# Altium project MAIN_BOARD.PrjPcb
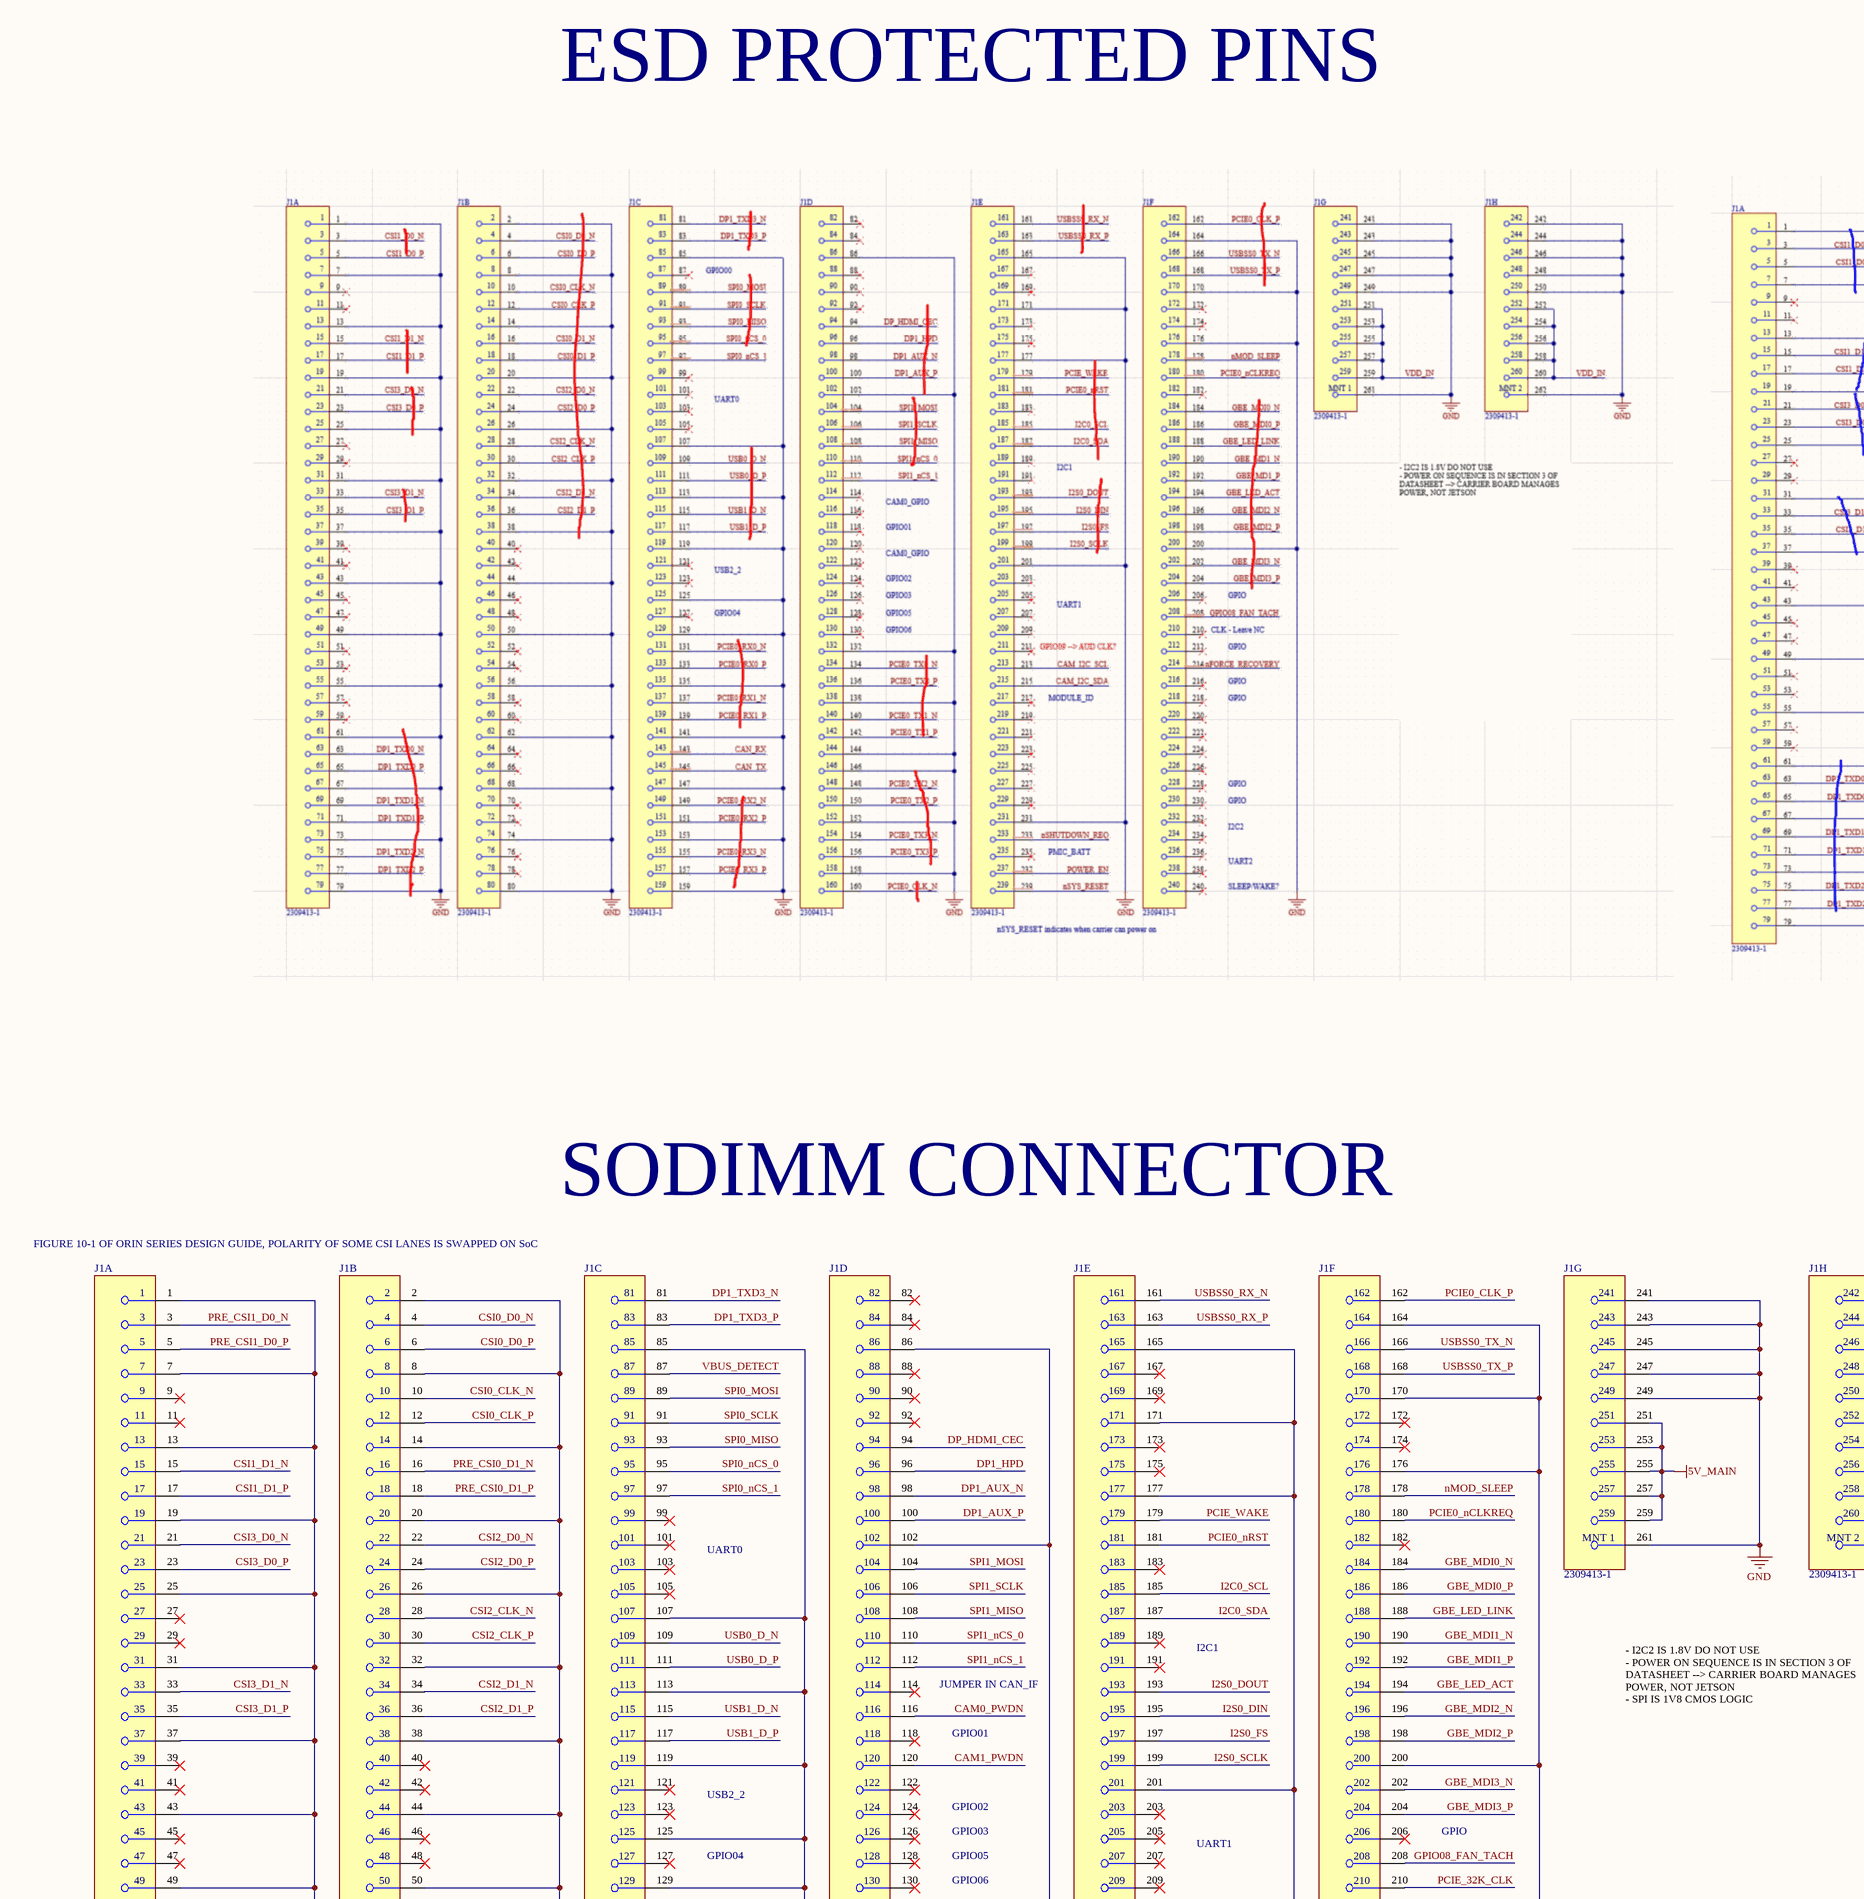
[diagram p0: JETSON.SchDoc, top left]
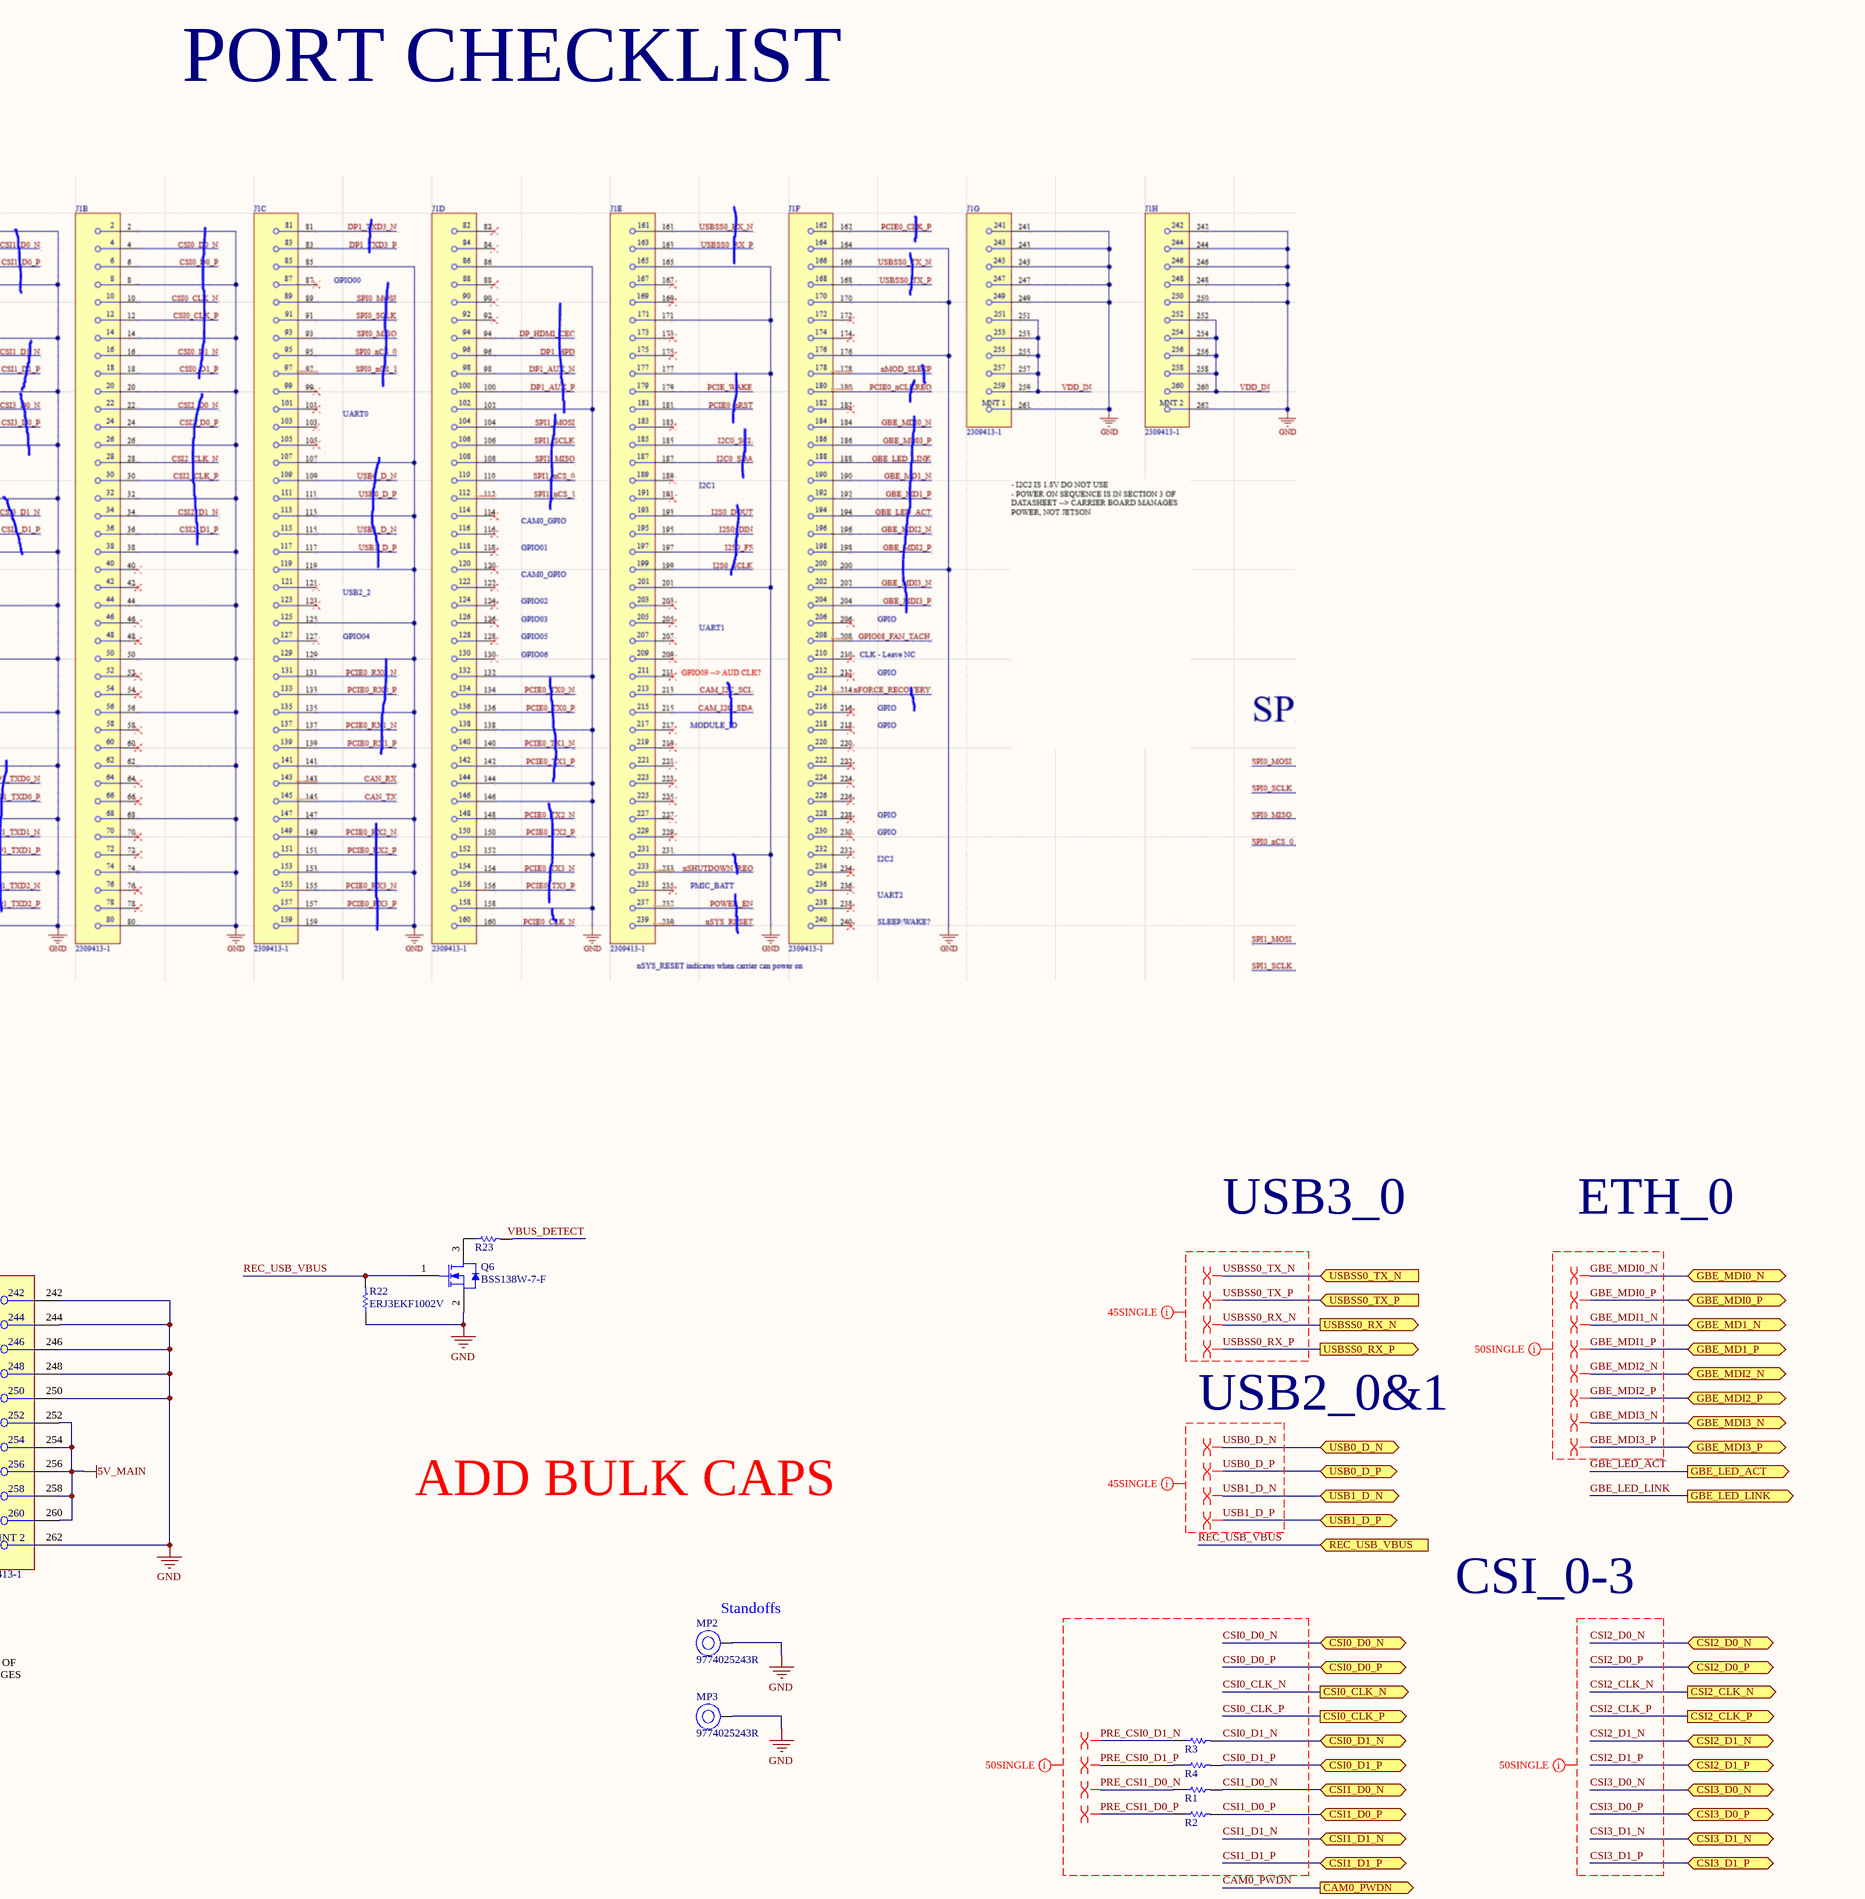
[diagram p1: JETSON.SchDoc, top right]
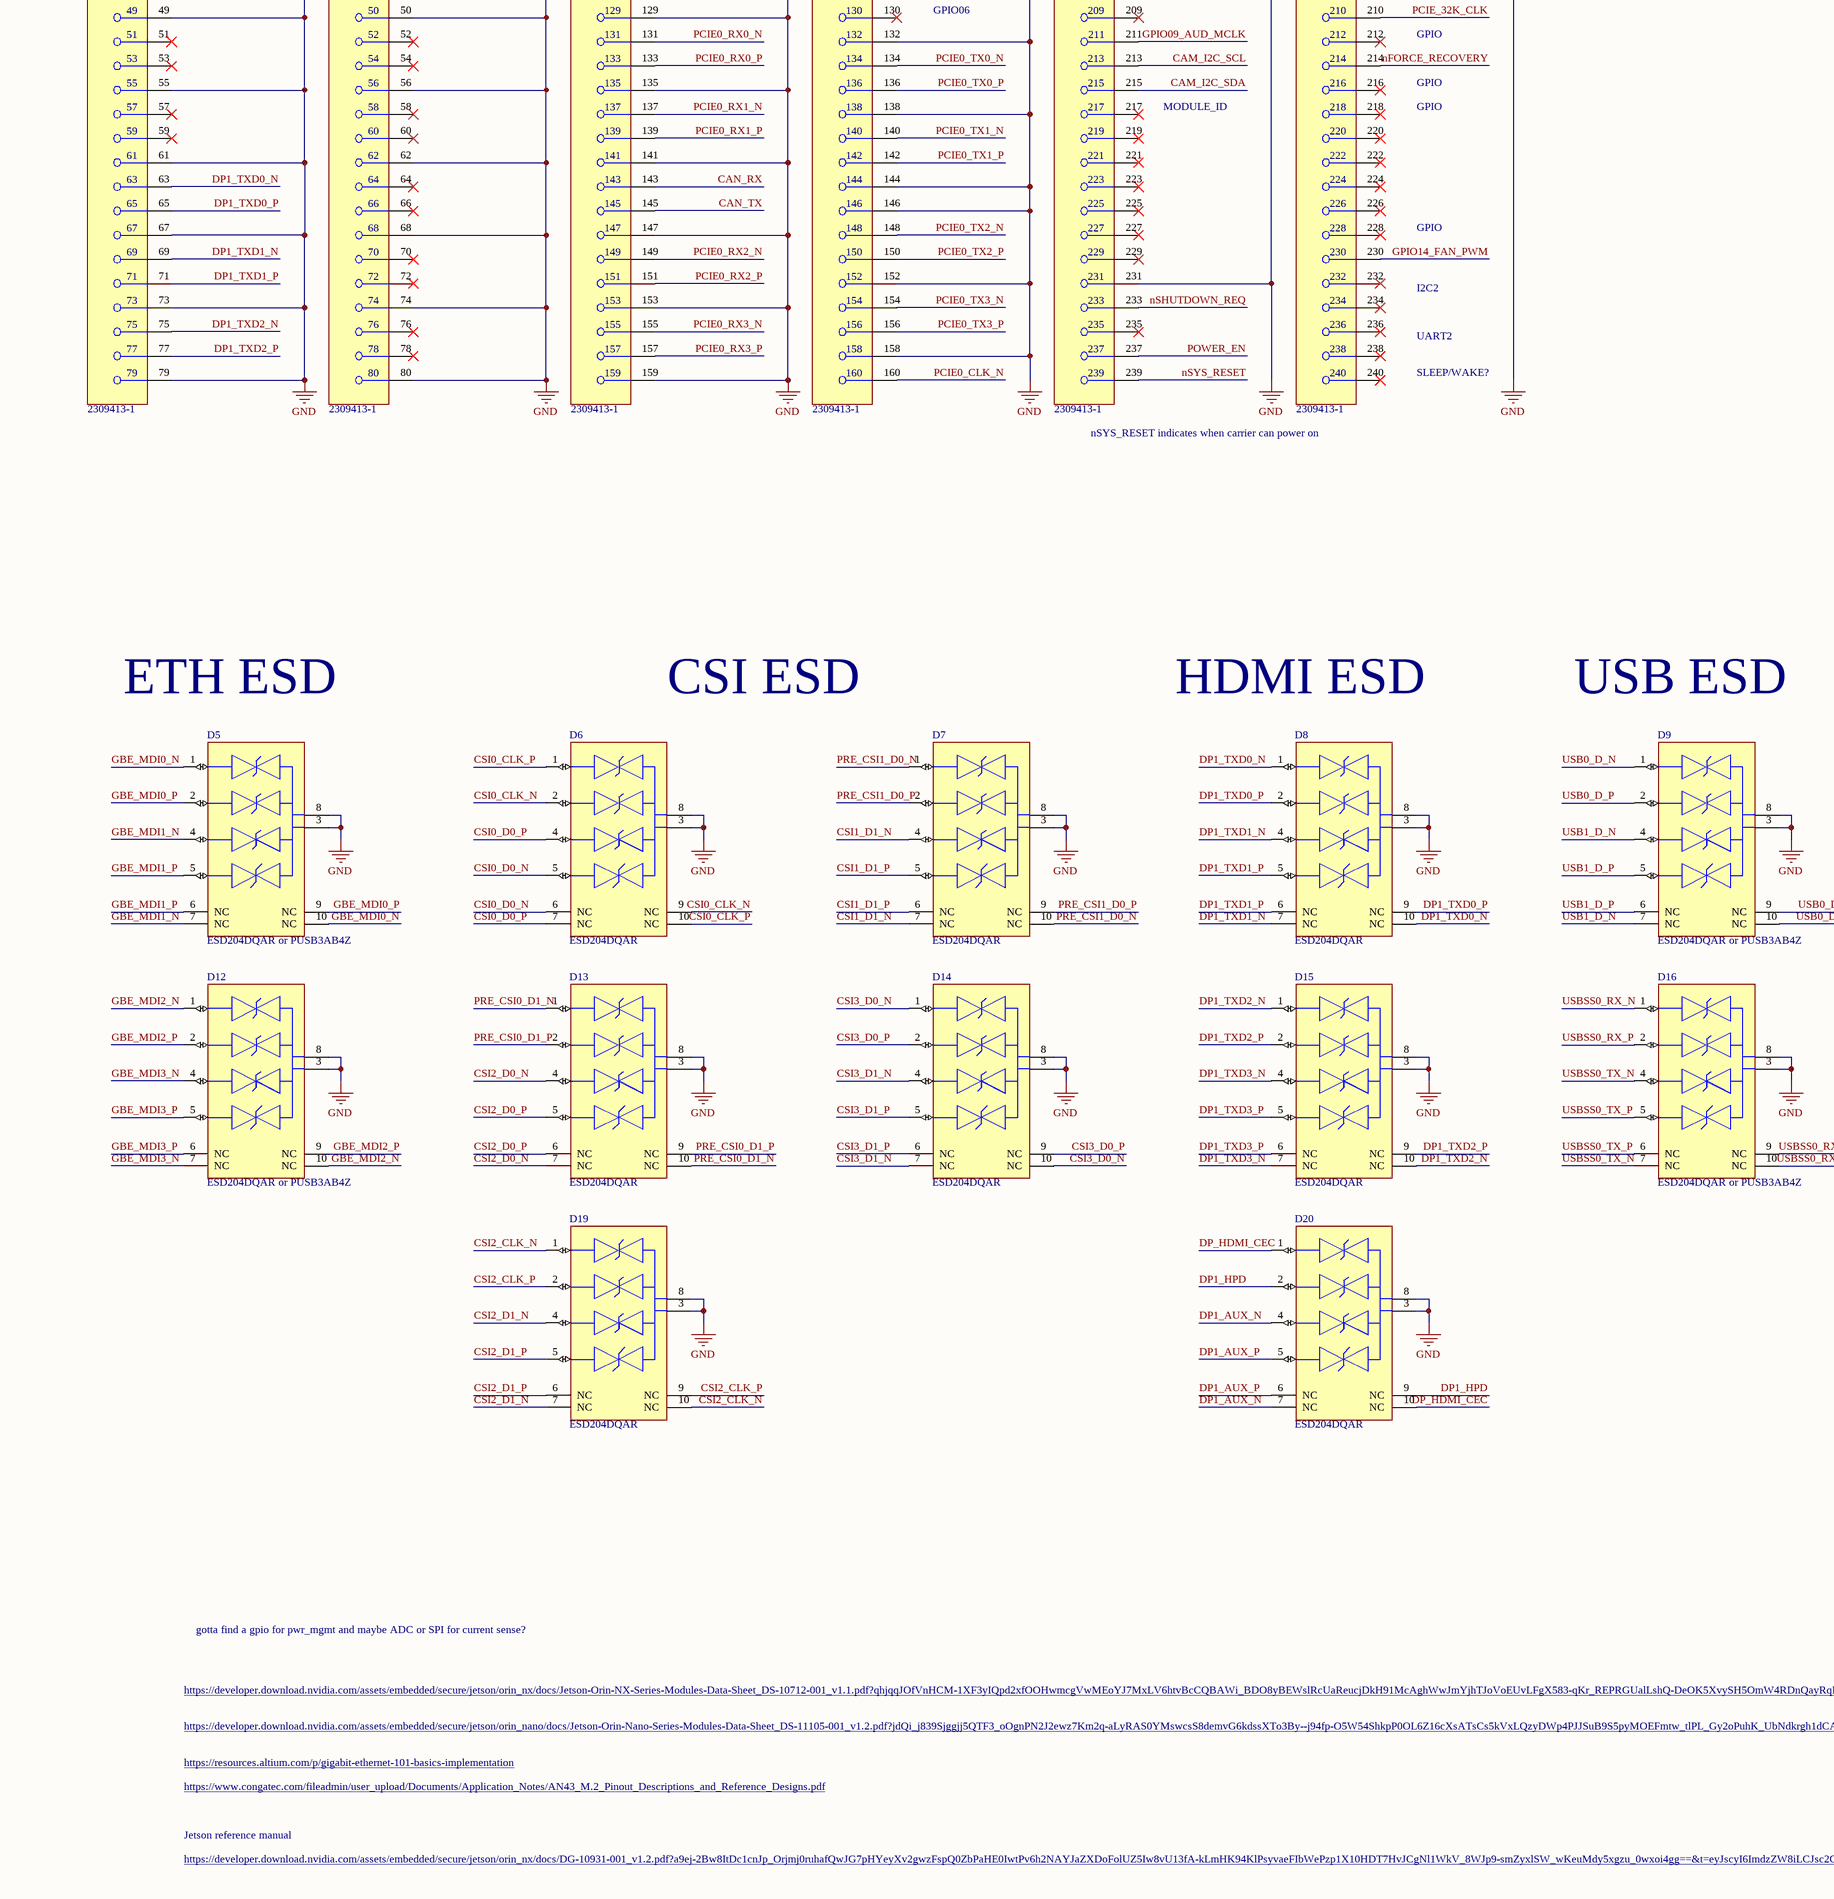
[diagram p2: JETSON.SchDoc, bottom left]
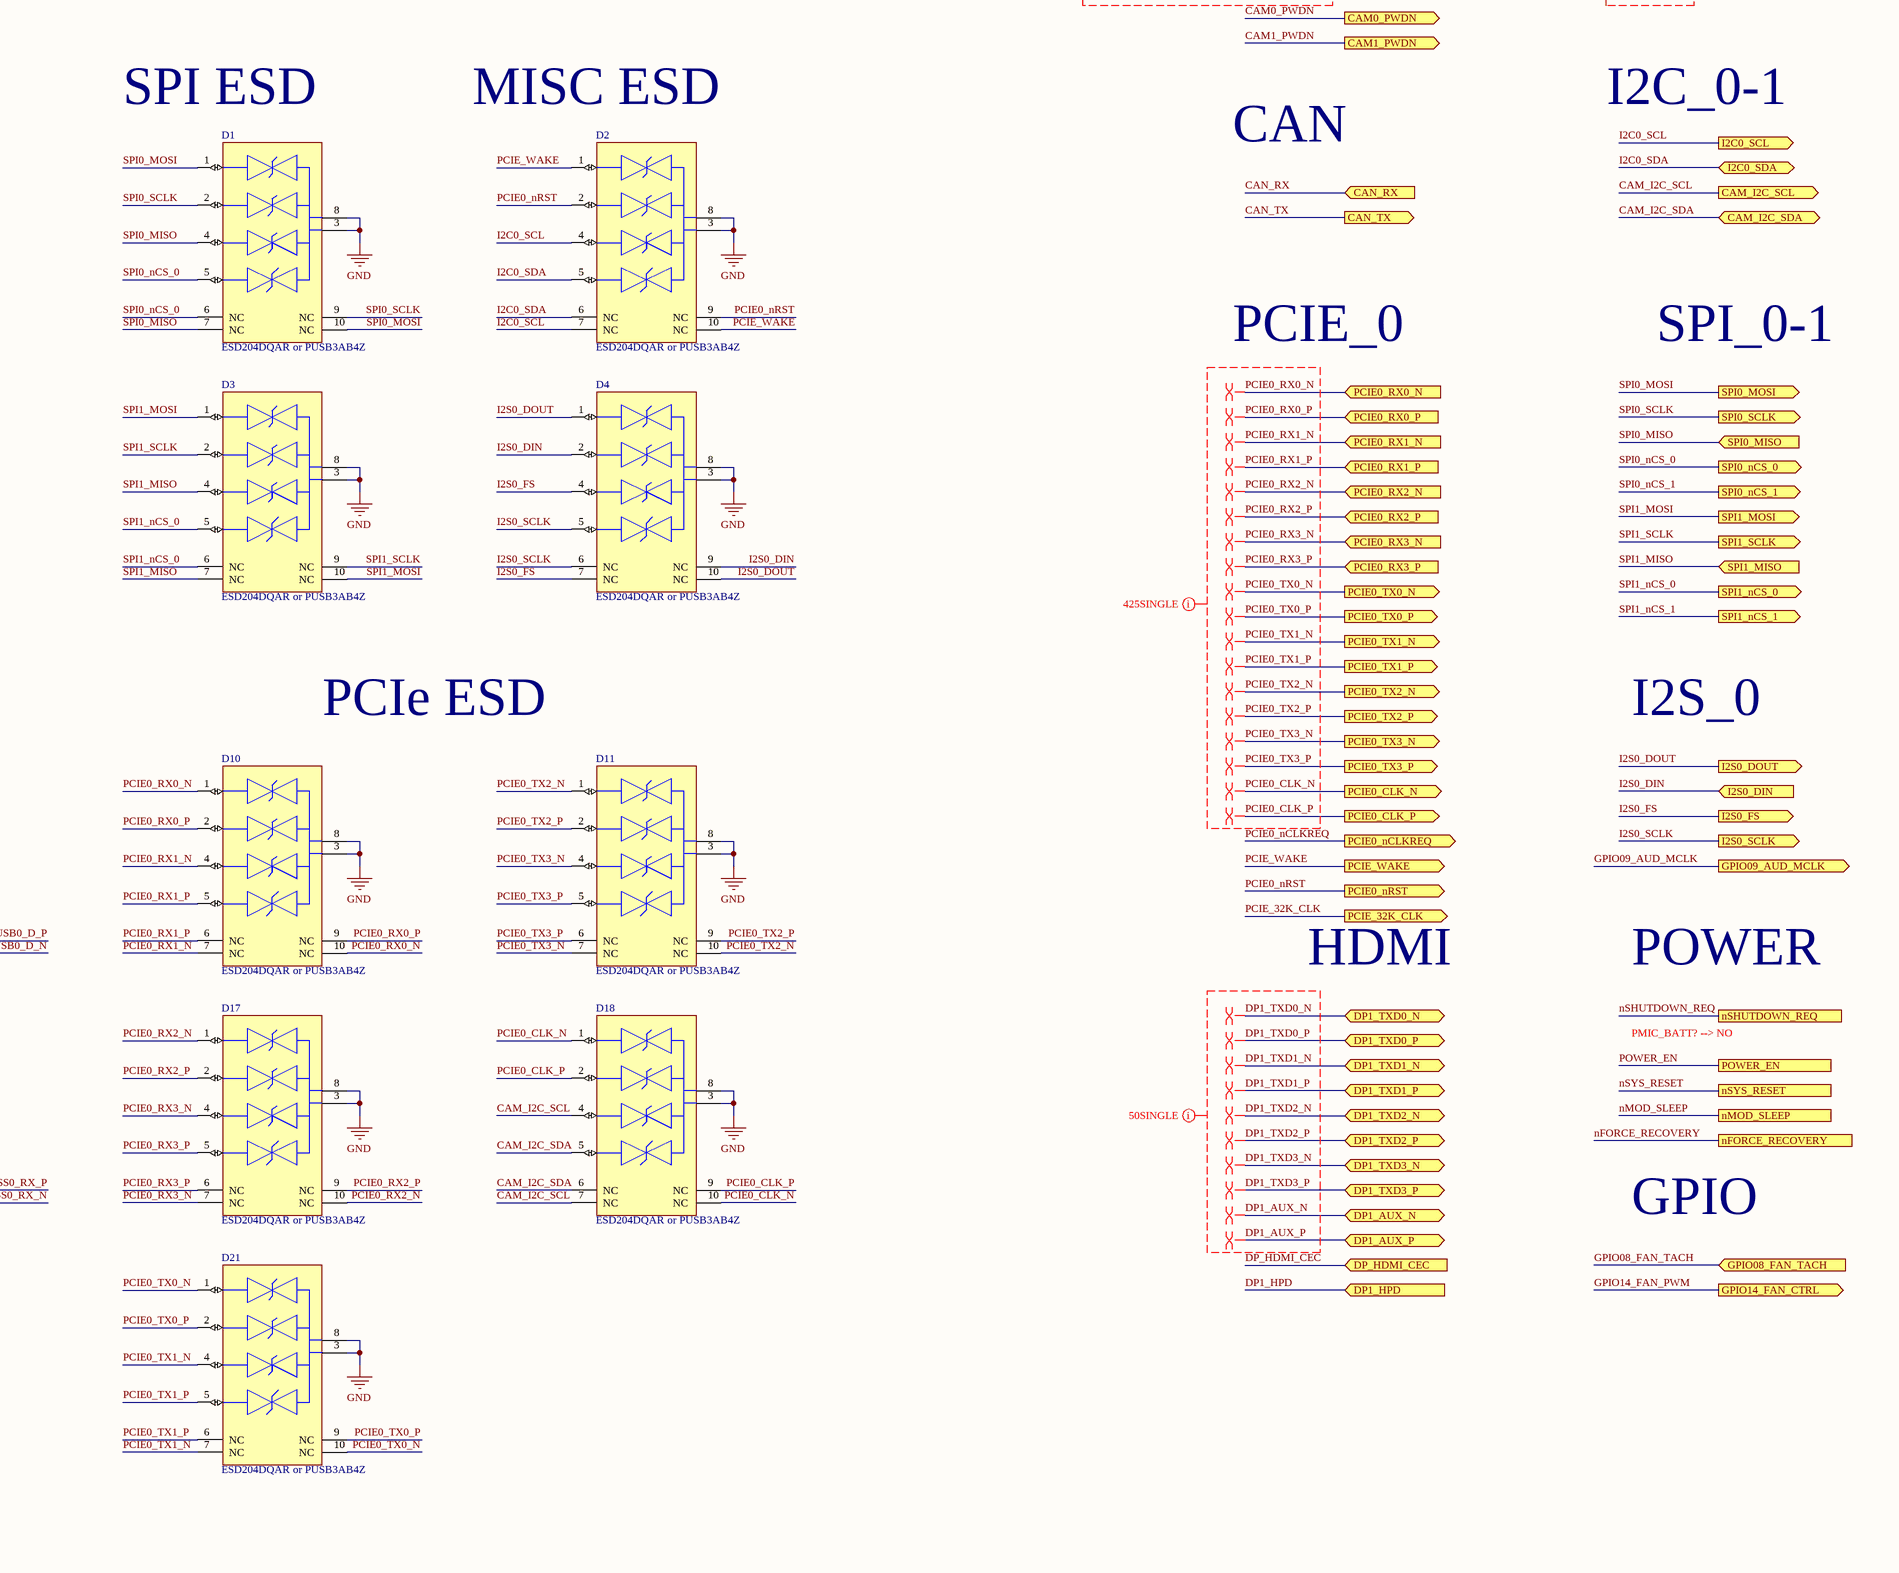
[diagram p3: JETSON.SchDoc, bottom right]
3 sheets, 113 parts. Net scope: flat (ports and power ports of the same name join across sheets).
Board files: MAIN_BOARD.PcbDoc, MAIN_BOARD_V2.PcbDoc
Sheets:
  JETSON.SchDoc
  CAMERA_INTERFACE.SchDoc
  FAN_IF.SchDoc

## Sheet JETSON.SchDoc
size D; SheetNumber: 2; SheetTotal: 9

### Parts
D1  ESD204DQAR or PUSB3AB4Z  [FP-DQA0010A-MFG]
D2  ESD204DQAR or PUSB3AB4Z  [FP-DQA0010A-MFG]
D3  ESD204DQAR or PUSB3AB4Z  [FP-DQA0010A-MFG]
D4  ESD204DQAR or PUSB3AB4Z  [FP-DQA0010A-MFG]
D5  ESD204DQAR or PUSB3AB4Z  [FP-DQA0010A-MFG]
D6  ESD204DQAR  [FP-DQA0010A-MFG]
D7  ESD204DQAR  [FP-DQA0010A-MFG]
D8  ESD204DQAR  [FP-DQA0010A-MFG]
D9  ESD204DQAR or PUSB3AB4Z  [FP-DQA0010A-MFG]
D10  ESD204DQAR or PUSB3AB4Z  [FP-DQA0010A-MFG]
D11  ESD204DQAR or PUSB3AB4Z  [FP-DQA0010A-MFG]
D12  ESD204DQAR or PUSB3AB4Z  [FP-DQA0010A-MFG]
D13  ESD204DQAR  [FP-DQA0010A-MFG]
D14  ESD204DQAR  [FP-DQA0010A-MFG]
D15  ESD204DQAR  [FP-DQA0010A-MFG]
D16  ESD204DQAR or PUSB3AB4Z  [FP-DQA0010A-MFG]
D17  ESD204DQAR or PUSB3AB4Z  [FP-DQA0010A-MFG]
D18  ESD204DQAR or PUSB3AB4Z  [FP-DQA0010A-MFG]
D19  ESD204DQAR  [FP-DQA0010A-MFG]
D20  ESD204DQAR  [FP-DQA0010A-MFG]
D21  ESD204DQAR or PUSB3AB4Z  [FP-DQA0010A-MFG]
J1  2309413-1  [FP-2309413-1-MFG]  (parts A,B,C,D,E,F,G,H of 8)
MP2  9774025243R  [9774025243]
MP3  9774025243R  [9774025243]
Q6  BSS138W-7-F  [DIOD-SOT323-3_V]
R1  0402 JUMPER 0 OHM  [RESC1005X40X25NL05T05]  (value not drawn)
R2  0402 JUMPER 0 OHM  [RESC1005X40X25NL05T05]  (value not drawn)
R3  0402 JUMPER 0 OHM  [RESC1005X40X25NL05T05]  (value not drawn)
R4  0402 JUMPER 0 OHM  [RESC1005X40X25NL05T05]  (value not drawn)
R22  ERJ3EKF1002V  [RESC1609X55X30LL15T15]
R23  0402 JUMPER 0 OHM  [RESC1005X40X25NL05T05]  (value not drawn)

### Ports
CAM0_PWDN (out, see MAIN_BOARD[5B]), CAM1_PWDN (out, see MAIN_BOARD[5C]), CAM_I2C_SCL (out, see MAIN_BOARD[5B], CAMERA_INTERFACE[1B]), CAM_I2C_SDA (bidir, see MAIN_BOARD[5B], CAMERA_INTERFACE[1B]), CAN_RX (in, see MAIN_BOARD[4D]), CAN_TX (out, see MAIN_BOARD[4D]), CSI0_CLK_N (out, see MAIN_BOARD[5B]), CSI0_CLK_P (out, see MAIN_BOARD[5B]), CSI0_D0_N (bidir, see MAIN_BOARD[5B]), CSI0_D0_P (bidir, see MAIN_BOARD[5B]), CSI0_D1_N (bidir, see MAIN_BOARD[5B]), CSI0_D1_P (bidir, see MAIN_BOARD[5B]), CSI1_D0_N (bidir, see MAIN_BOARD[5B]), CSI1_D0_P (bidir, see MAIN_BOARD[5B]), CSI1_D1_N (bidir, see MAIN_BOARD[5B]), CSI1_D1_P (bidir, see MAIN_BOARD[5B]), CSI2_CLK_N (out, see MAIN_BOARD[5C]), CSI2_CLK_P (out, see MAIN_BOARD[5C]), CSI2_D0_N (bidir, see MAIN_BOARD[5C]), CSI2_D0_P (bidir, see MAIN_BOARD[5C]), CSI2_D1_N (bidir, see MAIN_BOARD[5C]), CSI2_D1_P (bidir, see MAIN_BOARD[5C]), CSI3_D0_N (bidir, see MAIN_BOARD[5C]), CSI3_D0_P (bidir, see MAIN_BOARD[5C]), CSI3_D1_N (bidir, see MAIN_BOARD[5C]), CSI3_D1_P (bidir, see MAIN_BOARD[5C]), DP1_AUX_N (bidir, see MAIN_BOARD[5D], HDMI[1A]), DP1_AUX_P (bidir, see MAIN_BOARD[5D], HDMI[1A]), DP1_HPD (in, see MAIN_BOARD[5D]), DP1_TXD0_N (bidir, see MAIN_BOARD[5C]), DP1_TXD0_P (bidir, see MAIN_BOARD[5C]), DP1_TXD1_N (bidir, see MAIN_BOARD[5D]), DP1_TXD1_P (bidir, see MAIN_BOARD[5D]), DP1_TXD2_N (bidir, see MAIN_BOARD[5D]), DP1_TXD2_P (bidir, see MAIN_BOARD[5D]), DP1_TXD3_N (bidir, see MAIN_BOARD[5D]), DP1_TXD3_P (bidir, see MAIN_BOARD[5D]), DP_HDMI_CEC (in, see MAIN_BOARD[5D], HDMI[1A]), GBE_LED_ACT (out, see MAIN_BOARD[5C], ETHERNET[1B]), GBE_LED_LINK (out, see MAIN_BOARD[5C], ETHERNET[1B]), GBE_MD1_N (bidir, see MAIN_BOARD[5C]), GBE_MD1_P (bidir, see MAIN_BOARD[5C]), GBE_MDI0_N (bidir, see MAIN_BOARD[5C], ETHERNET[1A]), GBE_MDI0_P (bidir, see MAIN_BOARD[5C], ETHERNET[1A]), GBE_MDI2_N (bidir, see MAIN_BOARD[5C], ETHERNET[1A]), GBE_MDI2_P (bidir, see MAIN_BOARD[5C], ETHERNET[1A]), GBE_MDI3_N (bidir, see MAIN_BOARD[5C], ETHERNET[1B]), GBE_MDI3_P (bidir, see MAIN_BOARD[5C], ETHERNET[1A]), GPIO08_FAN_TACH (in), GPIO09_AUD_MCLK (out), GPIO14_FAN_CTRL (out), I2C0_SCL (out), I2C0_SDA (bidir), I2S0_DIN (in), I2S0_DOUT (out), I2S0_FS (out), I2S0_SCLK (out), nFORCE_RECOVERY, nMOD_SLEEP, nSHUTDOWN_REQ, nSYS_RESET, PCIE0_CLK_N (out, see MAIN_BOARD[5A], NVME[6B]), PCIE0_CLK_P (out, see MAIN_BOARD[5A], NVME[6B]), PCIE0_nCLKREQ (out, see MAIN_BOARD[5A]), PCIE0_nRST (out, see MAIN_BOARD[5A]), PCIE0_RX0_N (in, see MAIN_BOARD[5A], NVME[6B]), PCIE0_RX0_P (in, see MAIN_BOARD[5A], NVME[6B]), PCIE0_RX1_N (in, see MAIN_BOARD[5A], NVME[6B]), PCIE0_RX1_P (in, see MAIN_BOARD[5A], NVME[6B]), PCIE0_RX2_N (in, see MAIN_BOARD[5A], NVME[6B]), PCIE0_RX2_P (in, see MAIN_BOARD[5A], NVME[6B]), PCIE0_RX3_N (in, see MAIN_BOARD[5A], NVME[6B]), PCIE0_RX3_P (in, see MAIN_BOARD[5A], NVME[6B]), PCIE0_TX0_N (out, see MAIN_BOARD[5A], NVME[6A]), PCIE0_TX0_P (out, see MAIN_BOARD[5A], NVME[6A]), PCIE0_TX1_N (out, see MAIN_BOARD[5A], NVME[6A]), PCIE0_TX1_P (out, see MAIN_BOARD[5A], NVME[6A]), PCIE0_TX2_N (out, see MAIN_BOARD[5A], NVME[6A]), PCIE0_TX2_P (out, see MAIN_BOARD[5A], NVME[6A]), PCIE0_TX3_N (out, see MAIN_BOARD[5A], NVME[6A]), PCIE0_TX3_P (out, see MAIN_BOARD[5A], NVME[6A]), PCIE_32K_CLK (out), PCIE_WAKE (out, see MAIN_BOARD[5A]), POWER_EN, REC_USB_VBUS (in, see MAIN_BOARD[5D], RECOVERY_USBC[1A]), SPI0_MISO (in), SPI0_MOSI (out), SPI0_nCS_0 (out), SPI0_nCS_1 (out), SPI0_SCLK (out), SPI1_MISO (in), SPI1_MOSI (out), SPI1_nCS_0 (out), SPI1_nCS_1 (out), SPI1_SCLK (out), USB0_D_N (bidir, see MAIN_BOARD[5D], RECOVERY_USBC[1A]), USB0_D_P (bidir, see MAIN_BOARD[5D], RECOVERY_USBC[1A]), USB1_D_N (bidir, see MAIN_BOARD[5B]), USB1_D_P (bidir, see MAIN_BOARD[5B]), USBSS0_RX_N (out, see MAIN_BOARD[5B]), USBSS0_RX_P (out, see MAIN_BOARD[5B]), USBSS0_TX_N (in, see MAIN_BOARD[5B]), USBSS0_TX_P (in, see MAIN_BOARD[5B])

### Nets
5V_MAIN: J1.251 J1.252 J1.253 J1.254 J1.255 J1.256 J1.257 J1.258 J1.259 J1.260
GND: D1.3(GND) D1.8(GND) D2.3(GND) D2.8(GND) D3.3(GND) D3.8(GND) D4.3(GND) D4.8(GND) D5.3(GND) D5.8(GND) D6.3(GND) D6.8(GND) D7.3(GND) D7.8(GND) D8.3(GND) D8.8(GND) D9.3(GND) D9.8(GND) D10.3(GND) D10.8(GND) D11.3(GND) D11.8(GND) D12.3(GND) D12.8(GND) D13.3(GND) D13.8(GND) D14.3(GND) D14.8(GND) D15.3(GND) D15.8(GND) D16.3(GND) D16.8(GND) D17.3(GND) D17.8(GND) D18.3(GND) D18.8(GND) D19.3(GND) D19.8(GND) D20.3(GND) D20.8(GND) D21.3(GND) D21.8(GND) J1.1 J1.2 J1.7 J1.8 J1.13 J1.14 J1.19 J1.20 J1.25 J1.26 J1.31 J1.32 J1.37 J1.38 J1.43 J1.44 J1.49 J1.50 J1.55 J1.56 J1.61 J1.62 J1.67 J1.68 J1.73 J1.74 J1.79 J1.80 J1.85 J1.86 J1.102 J1.107 J1.113 J1.119 J1.125 J1.129 J1.132 J1.135 J1.138 J1.141 J1.144 J1.146 J1.147 J1.152 J1.153 J1.158 J1.159 J1.164 J1.165 J1.170 J1.171 J1.176 J1.177 J1.200 J1.201 J1.231 J1.241 J1.242 J1.243 J1.244 J1.245 J1.246 J1.247 J1.248 J1.249 J1.250 J1.261(MNT_1) J1.262(MNT_2) MP2.1 MP3.1 Q6.2(S) R22.1
CAM0_PWDN: J1.116 ; port CAM0_PWDN
CAM1_PWDN: J1.120 ; port CAM1_PWDN
CAM_I2C_SCL: D18.4(IO3) D18.7(NC) J1.213 ; port CAM_I2C_SCL
CAM_I2C_SDA: D18.5(IO4) D18.6(NC) J1.215 ; port CAM_I2C_SDA
CAN_RX: J1.143 ; port CAN_RX
CAN_TX: J1.145 ; port CAN_TX
CSI0_CLK_N: D6.2(IO2) D6.9(NC) J1.10 ; port CSI0_CLK_N
CSI0_CLK_P: D6.1(IO1) D6.10(NC) J1.12 ; port CSI0_CLK_P
CSI0_D0_N: D6.5(IO4) D6.6(NC) J1.4 ; port CSI0_D0_N
CSI0_D0_P: D6.4(IO3) D6.7(NC) J1.6 ; port CSI0_D0_P
CSI0_D1_N: R3.2 ; port CSI0_D1_N
CSI0_D1_P: R4.2 ; port CSI0_D1_P
CSI1_D0_N: R1.2 ; port CSI1_D0_N
CSI1_D0_P: R2.2 ; port CSI1_D0_P
CSI1_D1_N: D7.4(IO3) D7.7(NC) J1.15 ; port CSI1_D1_N
CSI1_D1_P: D7.5(IO4) D7.6(NC) J1.17 ; port CSI1_D1_P
CSI2_CLK_N: D19.1(IO1) D19.10(NC) J1.28 ; port CSI2_CLK_N
CSI2_CLK_P: D19.2(IO2) D19.9(NC) J1.30 ; port CSI2_CLK_P
CSI2_D0_N: D13.4(IO3) D13.7(NC) J1.22 ; port CSI2_D0_N
CSI2_D0_P: D13.5(IO4) D13.6(NC) J1.24 ; port CSI2_D0_P
CSI2_D1_N: D19.4(IO3) D19.7(NC) J1.34 ; port CSI2_D1_N
CSI2_D1_P: D19.5(IO4) D19.6(NC) J1.36 ; port CSI2_D1_P
CSI3_D0_N: D14.1(IO1) D14.10(NC) J1.21 ; port CSI3_D0_N
CSI3_D0_P: D14.2(IO2) D14.9(NC) J1.23 ; port CSI3_D0_P
CSI3_D1_N: D14.4(IO3) D14.7(NC) J1.33 ; port CSI3_D1_N
CSI3_D1_P: D14.5(IO4) D14.6(NC) J1.35 ; port CSI3_D1_P
DP1_AUX_N: D20.4(IO3) D20.7(NC) J1.98 ; port DP1_AUX_N
DP1_AUX_P: D20.5(IO4) D20.6(NC) J1.100 ; port DP1_AUX_P
DP1_HPD: D20.2(IO2) D20.9(NC) J1.96 ; port DP1_HPD
DP1_TXD0_N: D8.1(IO1) D8.10(NC) J1.63 ; port DP1_TXD0_N
DP1_TXD0_P: D8.2(IO2) D8.9(NC) J1.65 ; port DP1_TXD0_P
DP1_TXD1_N: D8.4(IO3) D8.7(NC) J1.69 ; port DP1_TXD1_N
DP1_TXD1_P: D8.5(IO4) D8.6(NC) J1.71 ; port DP1_TXD1_P
DP1_TXD2_N: D15.1(IO1) D15.10(NC) J1.75 ; port DP1_TXD2_N
DP1_TXD2_P: D15.2(IO2) D15.9(NC) J1.77 ; port DP1_TXD2_P
DP1_TXD3_N: D15.4(IO3) D15.7(NC) J1.81 ; port DP1_TXD3_N
DP1_TXD3_P: D15.5(IO4) D15.6(NC) J1.83 ; port DP1_TXD3_P
DP_HDMI_CEC: D20.1(IO1) D20.10(NC) J1.94 ; port DP_HDMI_CEC
GBE_LED_ACT: J1.194 ; port GBE_LED_ACT
GBE_LED_LINK: J1.188 ; port GBE_LED_LINK
GBE_MDI0_N: D5.1(IO1) D5.10(NC) J1.184 ; port GBE_MDI0_N
GBE_MDI0_P: D5.2(IO2) D5.9(NC) J1.186 ; port GBE_MDI0_P
GBE_MDI1_N: D5.4(IO3) D5.7(NC) J1.190 ; port GBE_MD1_N
GBE_MDI1_P: D5.5(IO4) D5.6(NC) J1.192 ; port GBE_MD1_P
GBE_MDI2_N: D12.1(IO1) D12.10(NC) J1.196 ; port GBE_MDI2_N
GBE_MDI2_P: D12.2(IO2) D12.9(NC) J1.198 ; port GBE_MDI2_P
GBE_MDI3_N: D12.4(IO3) D12.7(NC) J1.202 ; port GBE_MDI3_N
GBE_MDI3_P: D12.5(IO4) D12.6(NC) J1.204 ; port GBE_MDI3_P
GPIO08_FAN_TACH: J1.208 ; port GPIO08_FAN_TACH
GPIO09_AUD_MCLK: J1.211 ; port GPIO09_AUD_MCLK
GPIO14_FAN_PWM: J1.230 ; port GPIO14_FAN_CTRL
I2C0_SCL: D2.4(IO3) D2.7(NC) J1.185 ; port I2C0_SCL
I2C0_SDA: D2.5(IO4) D2.6(NC) J1.187 ; port I2C0_SDA
I2S0_DIN: D4.2(IO2) D4.9(NC) J1.195 ; port I2S0_DIN
I2S0_DOUT: D4.1(IO1) D4.10(NC) J1.193 ; port I2S0_DOUT
I2S0_FS: D4.4(IO3) D4.7(NC) J1.197 ; port I2S0_FS
I2S0_SCLK: D4.5(IO4) D4.6(NC) J1.199 ; port I2S0_SCLK
nFORCE_RECOVERY: J1.214 ; port nFORCE_RECOVERY
nMOD_SLEEP: J1.178 ; port nMOD_SLEEP
nSHUTDOWN_REQ: J1.233 ; port nSHUTDOWN_REQ
nSYS_RESET: J1.239 ; port nSYS_RESET
PCIE0_CLK_N: D18.1(IO1) D18.10(NC) J1.160 ; port PCIE0_CLK_N
PCIE0_CLK_P: D18.2(IO2) D18.9(NC) J1.162 ; port PCIE0_CLK_P
PCIE0_nCLKREQ: J1.180 ; port PCIE0_nCLKREQ
PCIE0_nRST: D2.2(IO2) D2.9(NC) J1.181 ; port PCIE0_nRST
PCIE0_RX0_N: D10.1(IO1) D10.10(NC) J1.131 ; port PCIE0_RX0_N
PCIE0_RX0_P: D10.2(IO2) D10.9(NC) J1.133 ; port PCIE0_RX0_P
PCIE0_RX1_N: D10.4(IO3) D10.7(NC) J1.137 ; port PCIE0_RX1_N
PCIE0_RX1_P: D10.5(IO4) D10.6(NC) J1.139 ; port PCIE0_RX1_P
PCIE0_RX2_N: D17.1(IO1) D17.10(NC) J1.149 ; port PCIE0_RX2_N
PCIE0_RX2_P: D17.2(IO2) D17.9(NC) J1.151 ; port PCIE0_RX2_P
PCIE0_RX3_N: D17.4(IO3) D17.7(NC) J1.155 ; port PCIE0_RX3_N
PCIE0_RX3_P: D17.5(IO4) D17.6(NC) J1.157 ; port PCIE0_RX3_P
PCIE0_TX0_N: D21.1(IO1) D21.10(NC) J1.134 ; port PCIE0_TX0_N
PCIE0_TX0_P: D21.2(IO2) D21.9(NC) J1.136 ; port PCIE0_TX0_P
PCIE0_TX1_N: D21.4(IO3) D21.7(NC) J1.140 ; port PCIE0_TX1_N
PCIE0_TX1_P: D21.5(IO4) D21.6(NC) J1.142 ; port PCIE0_TX1_P
PCIE0_TX2_N: D11.1(IO1) D11.10(NC) J1.148 ; port PCIE0_TX2_N
PCIE0_TX2_P: D11.2(IO2) D11.9(NC) J1.150 ; port PCIE0_TX2_P
PCIE0_TX3_N: D11.4(IO3) D11.7(NC) J1.154 ; port PCIE0_TX3_N
PCIE0_TX3_P: D11.5(IO4) D11.6(NC) J1.156 ; port PCIE0_TX3_P
PCIE_32K_CLK: J1.210 ; port PCIE_32K_CLK
PCIE_WAKE: D2.1(IO1) D2.10(NC) J1.179 ; port PCIE_WAKE
POWER_EN: J1.237 ; port POWER_EN
PRE_CSI0_D1_N: D13.1(IO1) D13.10(NC) J1.16 R3.1
PRE_CSI0_D1_P: D13.2(IO2) D13.9(NC) J1.18 R4.1
PRE_CSI1_D0_N: D7.1(IO1) D7.10(NC) J1.3 R1.1
PRE_CSI1_D0_P: D7.2(IO2) D7.9(NC) J1.5 R2.1
REC_USB_VBUS: Q6.1(G) R22.2 ; port REC_USB_VBUS
SPI0_MISO: D1.4(IO3) D1.7(NC) J1.93 ; port SPI0_MISO
SPI0_MOSI: D1.1(IO1) D1.10(NC) J1.89 ; port SPI0_MOSI
SPI0_nCS_0: D1.5(IO4) D1.6(NC) J1.95 ; port SPI0_nCS_0
SPI0_nCS_1: J1.97 ; port SPI0_nCS_1
SPI0_SCLK: D1.2(IO2) D1.9(NC) J1.91 ; port SPI0_SCLK
SPI1_MISO: D3.4(IO3) D3.7(NC) J1.108 ; port SPI1_MISO
SPI1_MOSI: D3.1(IO1) D3.10(NC) J1.104 ; port SPI1_MOSI
SPI1_nCS_0: D3.5(IO4) D3.6(NC) J1.110 ; port SPI1_nCS_0
SPI1_nCS_1: J1.112 ; port SPI1_nCS_1
SPI1_SCLK: D3.2(IO2) D3.9(NC) J1.106 ; port SPI1_SCLK
USB0_D_N: D9.1(IO1) D9.10(NC) J1.109 ; port USB0_D_N
USB0_D_P: D9.2(IO2) D9.9(NC) J1.111 ; port USB0_D_P
USB1_D_N: D9.4(IO3) D9.7(NC) J1.115 ; port USB1_D_N
USB1_D_P: D9.5(IO4) D9.6(NC) J1.117 ; port USB1_D_P
USBSS0_RX_N: D16.1(IO1) D16.10(NC) J1.161 ; port USBSS0_RX_N
USBSS0_RX_P: D16.2(IO2) D16.9(NC) J1.163 ; port USBSS0_RX_P
USBSS0_TX_N: D16.4(IO3) D16.7(NC) J1.166 ; port USBSS0_TX_N
USBSS0_TX_P: D16.5(IO4) D16.6(NC) J1.168 ; port USBSS0_TX_P
VBUS_DETECT: J1.87 R23.2
NetQ6_3: Q6.3(D) R23.1

Not connected (* = marked no-connect by the designer): J1 9* 11* 27* 29* 39* 40* 41* 42* 45* 46* 47* 48* 51* 52* 53* 54* 57* 58* 59* 60* 64* 66* 70* 72* 76* 78* 82* 84* 88* 90* 92* 99* 101* 103* 105* 114* 118* 121* 122* 123* 124* 126* 127* 128* 130* 167* 169* 172* 173* 174* 175* 182* 183* 189* 191* 203* 205* 206* 207* 209* 212* 216* 217* 218* 219* 220* 221* 222* 223* 224* 225* 226* 227* 228* 229* 232* 234* 235* 236* 238* 240*

### Layout directives
net class 425SINGLE: PCIE0_CLK_N, PCIE0_CLK_P, PCIE0_RX0_N, PCIE0_RX0_P, PCIE0_RX1_N, PCIE0_RX1_P, PCIE0_RX2_N, PCIE0_RX2_P, PCIE0_RX3_N, PCIE0_RX3_P, PCIE0_TX0_N, PCIE0_TX0_P, PCIE0_TX1_N, PCIE0_TX1_P, PCIE0_TX2_N, PCIE0_TX2_P, PCIE0_TX3_N, PCIE0_TX3_P
net class 45SINGLE: USB0_D_N, USB0_D_P, USB1_D_N, USB1_D_P, USBSS0_RX_N, USBSS0_RX_P, USBSS0_TX_N, USBSS0_TX_P
net class 50SINGLE: CSI0_CLK_N, CSI0_CLK_P, CSI0_D0_N, CSI0_D0_P, CSI0_D1_N, CSI0_D1_P, CSI1_D0_N, CSI1_D0_P, CSI1_D1_N, CSI1_D1_P, CSI2_CLK_N, CSI2_CLK_P, CSI2_D0_N, CSI2_D0_P, CSI2_D1_N, CSI2_D1_P, CSI3_D0_N, CSI3_D0_P, CSI3_D1_N, CSI3_D1_P, DP1_AUX_N, DP1_AUX_P, DP1_TXD0_N, DP1_TXD0_P, DP1_TXD1_N, DP1_TXD1_P, DP1_TXD2_N, DP1_TXD2_P, DP1_TXD3_N, DP1_TXD3_P, GBE_MDI0_N, GBE_MDI0_P, GBE_MDI1_N, GBE_MDI1_P, GBE_MDI2_N, GBE_MDI2_P, GBE_MDI3_N, GBE_MDI3_P, PRE_CSI0_D1_N, PRE_CSI0_D1_P, PRE_CSI1_D0_N, PRE_CSI1_D0_P
differential pair; differential pair class 85DIFF: PCIE0_CLK_N, PCIE0_CLK_P, PCIE0_RX0_N, PCIE0_RX0_P, PCIE0_RX1_N, PCIE0_RX1_P, PCIE0_RX2_N, PCIE0_RX2_P, PCIE0_RX3_N, PCIE0_RX3_P, PCIE0_TX0_N, PCIE0_TX0_P, PCIE0_TX1_N, PCIE0_TX1_P, PCIE0_TX2_N, PCIE0_TX2_P, PCIE0_TX3_N, PCIE0_TX3_P
differential pair; differential pair class 90DIFF: USB0_D_N, USB0_D_P, USB1_D_N, USB1_D_P, USBSS0_RX_N, USBSS0_RX_P, USBSS0_TX_N, USBSS0_TX_P
differential pair; differential pair class 100DIFF: DP1_AUX_N, DP1_AUX_P, DP1_TXD0_N, DP1_TXD0_P, DP1_TXD1_N, DP1_TXD1_P, DP1_TXD2_N, DP1_TXD2_P, DP1_TXD3_N, DP1_TXD3_P, GBE_MDI0_N, GBE_MDI0_P, GBE_MDI1_N, GBE_MDI1_P, GBE_MDI2_N, GBE_MDI2_P, GBE_MDI3_N, GBE_MDI3_P, PRE_CSI0_D1_N, PRE_CSI0_D1_P, PRE_CSI1_D0_N, PRE_CSI1_D0_P

### Notes on the sheet
- ESD PROTECTED PINS
- PORT CHECKLIST
- SODIMM CONNECTOR
- USB3_0
- ETH_0
- FIGURE 10-1 OF ORIN SERIES DESIGN GUIDE, POLARITY OF SOME CSI LANES IS SWAPPED ON SoC
- USB2_0&1
- ADD BULK CAPS
- UART0
- CSI_0-3
- I2C1
- (near MP2) Standoffs
- JUMPER IN CAN_IF
- GPIO01
- USB2_2
- GPIO02
- GPIO03
- UART1
- GPIO
- GPIO04
- GPIO05
- GPIO06
- MODULE_ID
- - I2C2 IS 1.8V DO NOT USE
  - POWER ON SEQUENCE IS IN SECTION 3 OF DATASHEET --> CARRIER BOARD MANAGES POWER, NOT JETSON
  - SPI IS 1V8 CMOS LOGIC
- SPI ESD
- MISC ESD
- CAN
- I2C_0-1
- I2C2
- UART2
- PCIE_0
- SPI_0-1
- SLEEP/WAKE?
- nSYS_RESET indicates when carrier can power on
- ETH ESD
- CSI ESD
- HDMI ESD
- USB ESD
- PCIe ESD
- I2S_0
- HDMI
- POWER
- PMIC_BATT? --> NO
- gotta find a gpio for pwr_mgmt and maybe ADC or SPI for current sense?
- https://developer.download.nvidia.com/assets/embedded/secure/jetson/orin_nx/docs/Jetson-Orin-NX-Series-Modules-Data-Sheet_DS-10712-001_v1.1.pdf?qhjqqJOfVnHCM-1XF3yIQpd2xfOOHwmcgVwMEoYJ7MxLV6htvBcCQBAWi_BDO8yBEWslRcUaReucjDkH91McAghWwJmYjhTJoVoEUvLFgX583-qKr_REPRGUalLshQ-DeOK5XvySH5OmW4RDnQayRqIhzIBBSUWPjFaWLdJjM1JhWiyI3hM5VtWcQCIuw7hGP4sJ7ZLCMgQXeMz6eFhUxr5xiOQPPyQ1&t=eyJscyI6ImdzZW8iLCJsc2QiOiJodHRwczovL3d3dy5nb29nbGUuY29tLyJ9
- https://developer.download.nvidia.com/assets/embedded/secure/jetson/orin_nano/docs/Jetson-Orin-Nano-Series-Modules-Data-Sheet_DS-11105-001_v1.2.pdf?jdQi_j839Sjggjj5QTF3_oOgnPN2J2ewz7Km2q-aLyRAS0YMswcsS8demvG6kdssXTo3By--j94fp-O5W54ShkpP0OL6Z16cXsATsCs5kVxLQzyDWp4PJJSuB9S5pyMOEFmtw_tlPL_Gy2oPuhK_UbNdkrgh1dCA55zEuK928asFQhAHapZ0s__KiE7erU3EBWJIZ94vBC5BwytStbskK9hDtogPdFhuGCQNTg==&t=eyJscyI6ImdzZW8iLCJsc2QiOiJodHRwczovL3d3dy5nb29nbGUuY29tLyJ9
- https://resources.altium.com/p/gigabit-ethernet-101-basics-implementation
- https://www.congatec.com/fileadmin/user_upload/Documents/Application_Notes/AN43_M.2_Pinout_Descriptions_and_Reference_Designs.pdf
- Jetson reference manual
- https://developer.download.nvidia.com/assets/embedded/secure/jetson/orin_nx/docs/DG-10931-001_v1.2.pdf?a9ej-2Bw8ItDc1cnJp_Orjmj0ruhafQwJG7pHYeyXv2gwzFspQ0ZbPaHE0IwtPv6h2NAYJaZXDoFolUZ5Iw8vU13fA-kLmHK94KlPsyvaeFIbWePzp1X10HDT7HvJCgNl1WkV_8WJp9-smZyxlSW_wKeuMdy5xgzu_0wxoi4gg==&t=eyJscyI6ImdzZW8iLCJsc2QiOiJodHRwczovL3d3dy5nb29nbGUuY29tLyJ9

### Library data of the parts
D1-D21 = CMP-04989-000002-1: 4-CHANNEL LOW-CAPACITANCE SURGE; Manufacturer: Texas Instruments; Value: 0.55pF; Reverse Standoff Voltage: 3.6V; Standoff Height: 0mm; Breakdown Voltage: 5.5V; Peak Pulse Current: 5.5A; Clamping Voltage: 11.5V; Direction: Bidirectional; Peak Pulse Power: 50W; Number Of Channels: 4; Ambient Temperature Range High: +125°C; ComponentLink2Description: Datasheet; Height: 0.55mm; Lead Free: Yes; Device Class L3: unset; Temperature Range High: +125°C; Temperature Range Low: -40°C; Package: DQA0010A; Temperature: -40°C to +125°C; Capacitance: 0.55pF; RoHS: TRUE; Mouser Description: 4-Channel Low-Capacitance Surge and ESD Protection Diode 10-USON -40 to 125; Category: Diode; Device Class L1: Circuit Protection; Octopart: https://octopart.com/esd204dqar-texas+instruments-89917476; Device Class L2: TVS Diodes; Ambient Temperature Range Low: -40°C; Manufacturer Part Number: ESD204DQAR; ComponentLink2URL: http://www.ti.com/lit/ds/symlink/esd204.pdf; Automotive: No; Digikey Description: 4-CHANNEL LOW-CAPACITANCE SURGE
J1 = CMP-03356-000001-1: DDR4 SODIMM 260P 9.2H STD; Manufacturer: TE Connectivity; Voltage Rating: 25V; Current Rating: 0.5A; Is Female: yes; Pitch: 0.5mm; Memory Type: SDRAM,DDR; Conn Orientation: Horizontal; Number Of Contacts: 260; Temperature: -55°C to +85°C; Octopart: https://octopart.com/2309413-1-te+connectivity-84799194; Device Class L3: unset; Contact Material: Gold,Nickel; ComponentLink2URL: https://www.te.com/commerce/DocumentDelivery/DDEController?Action=showdoc&DocId=Specification+Or+Standard%7F108-115122%7FA1%7Fpdf%7FEnglish%7FENG_SS_108-115122_A1.pdf%7F2309413-1; Manufacturer Part Number: 2309413-1; ComponentLink2Description: Datasheet; Digikey Description: DDR4 SODIMM 260P 9.2H STD; Height: 18.8mm; Footprint Url: https://www.te.com/commerce/DocumentDelivery/DDEController?Action=showdoc&DocId=Customer+Drawing%7F2309413%7F4%7Fpdf%7FEnglish%7FENG_CD_2309413_4.pdf%7F2309413-1; Temperature Range Low: -55°C; Device Class L2: Memory Connectors; Temperature Range High: +85°C; RoHS: TRUE; Automotive: No; Device Class L1: Connectors; Mouser Description: Conn DDR4 DIMM Socket SKT 260 POS 0.5mm Solder RA SMD T/R; Category: Conn; Package: 0; Lead Free: Yes
MP2 MP3 = CMP-03913-59774857-1: 9774025243R Spacer Material: Steel, Tin-Plated Mounting: SMT Series: WA-SMST Thread D: M2; Outside Diameter: 4.3434mm; Threaded/Unthreaded: Threaded; Plating: Tin; REACH SVHC: Unknown; NexarPartId: 59774857; RoHS: Compliant; Material: Steel; Packaging: Tape and Reel; Max Operating Temperature: 150°C; Min Operating Temperature: -55°C; Length: 2.5mm; Height: 2.5mm
Q6 = CMP-2000-05968-1: N-Channel Enhancement Mode Mosfet, 50 V, 200 mA, -55 to 150 degC, 6-Pin SOT-323, RoHS, Tape and Reel; Typical Turn-Off Delay Time: 20ns; Number of Channels: 1Channel; Type: EnhancementModeFieldEffectTransistor; Brand: DiodesIncorporated; Vds - Drain-Source Breakdown Voltage: 75V; Vgs - Gate-Source Voltage: 20V; Rds On - Drain-Source Resistance: 1.4Ohms; Transistor Type: 1N-Channel; Configuration: Single; Unit Weight: 0.000212oz; Pd - Power Dissipation: 200mW; Id - Continuous Drain Current: 200mA; Forward Transconductance - Min: 0.1S; Manufacturer URL: http://www.diodes.com/; Series: BSS138; Package Description: 3-Pin Small Outline Transistor, Body 2 x 1.25 mm, Pitch 0.65 mm; Mounting Technology: SurfaceMount; Product Category: MOSFET; RoHS: True; Maximum Operating Temperature: +150C; Height: 1mm; Length: 2.2mm; Technology: Si; Width: 1.35mm; Datasheet URL: http://www.diodes.com/_files/datasheets/ds30206.pdf; Manufacturer: DiodesIncorporated; Package / Case: SOT-323-3; Typical Turn-On Delay Time: 20ns; Transistor Polarity: N-Channel; Factory Pack Quantity: 3000; Packaging: Reel; Product: MOSFETSmallSignal; Datasheet Version: Rev. 11-2, 09/2013; Package Reference: SOT323; Minimum Operating Temperature: -55C; Mounting Style: SMD/SMT; Channel Mode: Enhancement
R1-R4 R23 = CMP-009-00206-2: READ THE NAME
R22 = CMP-1012-00623-3: Chip Resistor, 10 KOhm, +/- 1%, 0.1 W, -55 to 155 degC, 0603 (1608 Metric), RoHS, Tape and Reel; Manufacturer: Panasonic; Voltage Rating: 75V; Case\/Package: 0603; Power Rating: 100mW; Resistance: 10KOhm; Temperature Coefficient: 100ppm\/degreesC; Number of Pins: 2; Package Reference: 603; Depth: 0.8mm; Mount: SurfaceMount; Package Description: 2-Pin Surface Mount Device, Body 1.6 x 0.85 mm; Datasheet Version: 02/2017; Length: 1.6mm; Lead Free: LeadFree; Height: 0.45mm; Number of Terminations: 2; Max Power Dissipation: 100mW; Min Operating Temperature: -55degC; Datasheet URL: https://industrial.panasonic.com/cdbs/www-data/pdf/RDA0000/AOA0000C304.pdf; Termination: SMD/SMT; Case Code (Metric): 1608; Case Code (Imperial): 0603; Tolerance: 1%; Max Operating Temperature: 155degC; RoHSCompliant: true; Voltage Rating (DC): 75V; Radiation Hardening: No; Packaging: TapeandReel; Composition: ThickFilm; Mounting Technology: SurfaceMount; Manufacturer URL: http://www.panasonic.com/; Width: 0.031inch; REACH SVHC: NoSVHC; Contact Plating: Tin; Military Standard: Not; Package Quantity: 1

## Sheet CAMERA_INTERFACE.SchDoc
size C; SheetNumber: 3; SheetTotal: 9
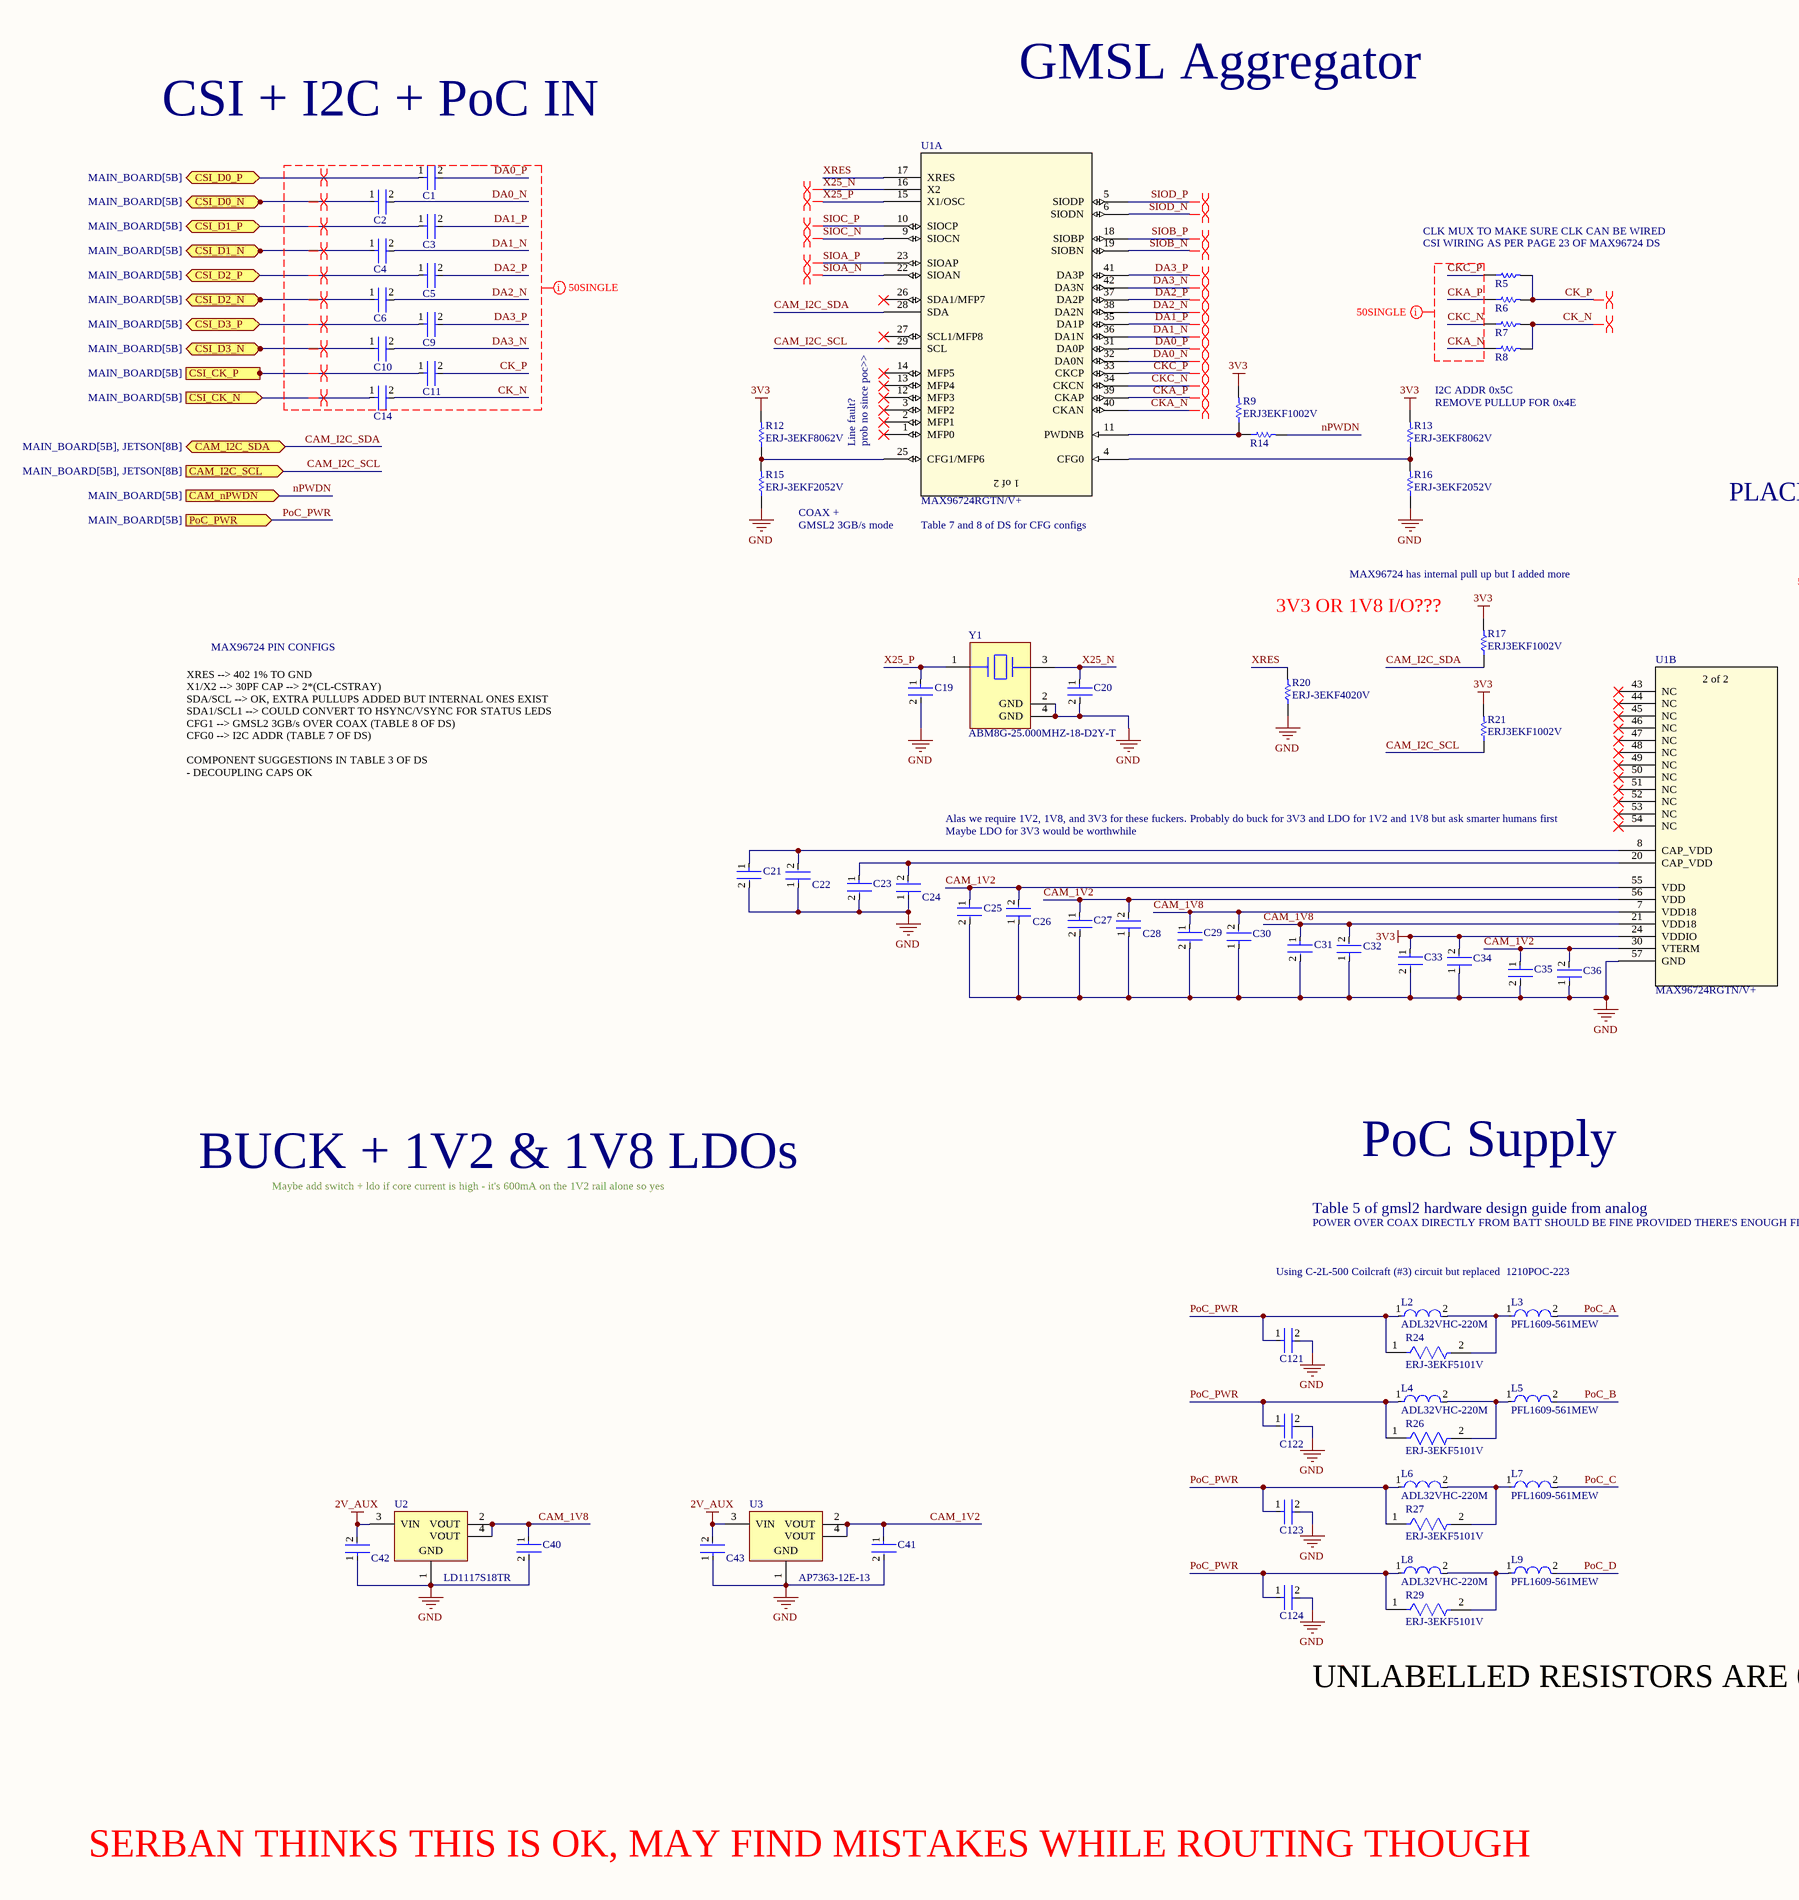
[diagram p4: CAMERA_INTERFACE.SchDoc, left]
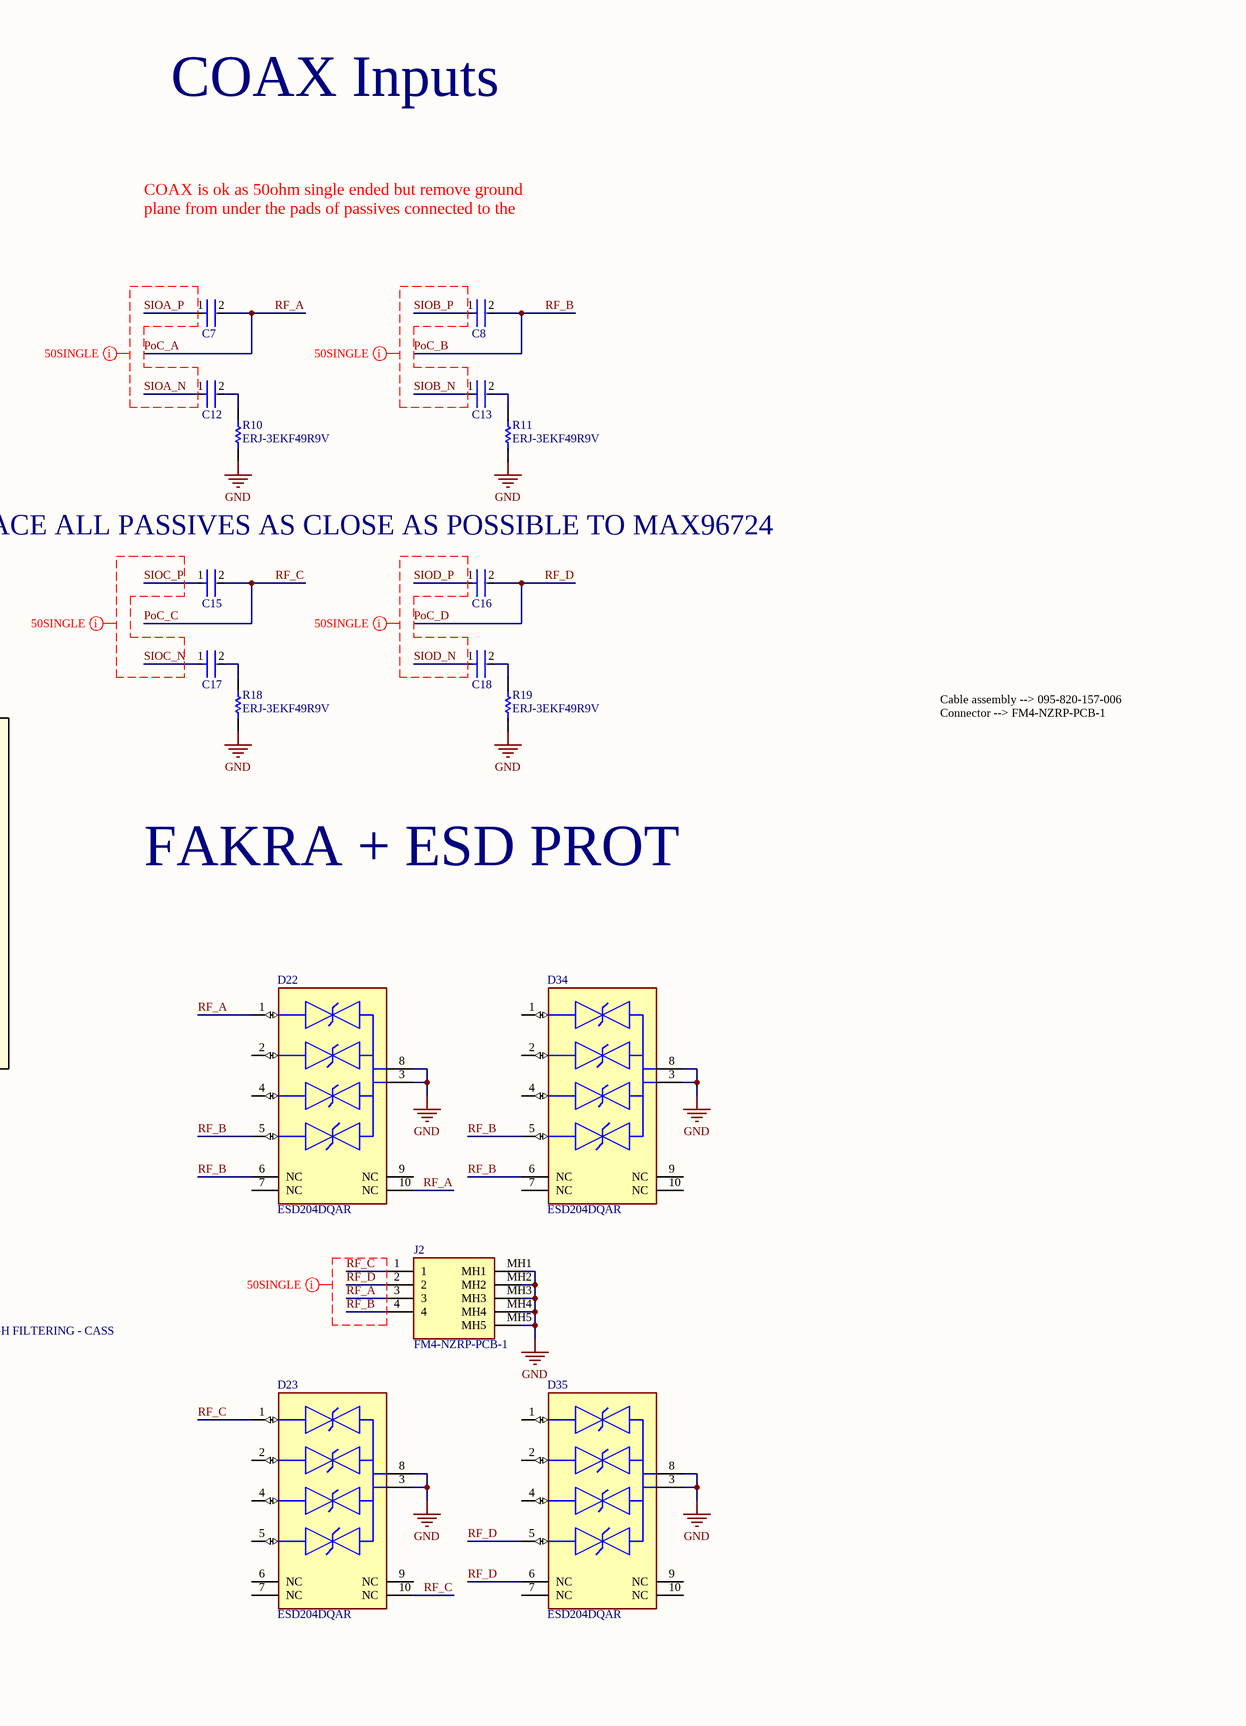
[diagram p5: CAMERA_INTERFACE.SchDoc, right]

### Parts
C1  C1005X7R1H104K050BB  [FP-C1005-050-0_05-IPC_C]  (value not drawn)
C2  C1005X7R1H104K050BB  [FP-C1005-050-0_05-IPC_C]  (value not drawn)
C3  C1005X7R1H104K050BB  [FP-C1005-050-0_05-IPC_C]  (value not drawn)
C4  C1005X7R1H104K050BB  [FP-C1005-050-0_05-IPC_C]  (value not drawn)
C5  C1005X7R1H104K050BB  [FP-C1005-050-0_05-IPC_C]  (value not drawn)
C6  C1005X7R1H104K050BB  [FP-C1005-050-0_05-IPC_C]  (value not drawn)
C7  C1005X7R1H104K050BB  [FP-C1005-050-0_05-IPC_C]  (value not drawn)
C8  C1005X7R1H104K050BB  [FP-C1005-050-0_05-IPC_C]  (value not drawn)
C9  C1005X7R1H104K050BB  [FP-C1005-050-0_05-IPC_C]  (value not drawn)
C10  C1005X7R1H104K050BB  [FP-C1005-050-0_05-IPC_C]  (value not drawn)
C11  C1005X7R1H104K050BB  [FP-C1005-050-0_05-IPC_C]  (value not drawn)
C12  C1005X7R1H104K050BB  [FP-C1005-050-0_05-IPC_C]  (value not drawn)
C13  C1005X7R1H104K050BB  [FP-C1005-050-0_05-IPC_C]  (value not drawn)
C14  C1005X7R1H104K050BB  [FP-C1005-050-0_05-IPC_C]  (value not drawn)
C15  C1005X7R1H104K050BB  [FP-C1005-050-0_05-IPC_C]  (value not drawn)
C16  C1005X7R1H104K050BB  [FP-C1005-050-0_05-IPC_C]  (value not drawn)
C17  C1005X7R1H104K050BB  [FP-C1005-050-0_05-IPC_C]  (value not drawn)
C18  C1005X7R1H104K050BB  [FP-C1005-050-0_05-IPC_C]  (value not drawn)
C19  C0603C300J5GACTU  [FP-C0603C-CF-MFG]  (value not drawn)
C20  C0603C300J5GACTU  [FP-C0603C-CF-MFG]  (value not drawn)
C21  CL05A106MP5NUNC  [FP-CL05A106MP5NUNC-MFG]  (value not drawn)
C22  C1005X7R1H104K050BB  [FP-C1005-050-0_05-IPC_C]  (value not drawn)
C23  CL05A106MP5NUNC  [FP-CL05A106MP5NUNC-MFG]  (value not drawn)
C24  C1005X7R1H104K050BB  [FP-C1005-050-0_05-IPC_C]  (value not drawn)
C25  CL05A106MP5NUNC  [FP-CL05A106MP5NUNC-MFG]  (value not drawn)
C26  C1005X7R1H104K050BB  [FP-C1005-050-0_05-IPC_C]  (value not drawn)
C27  CL05A106MP5NUNC  [FP-CL05A106MP5NUNC-MFG]  (value not drawn)
C28  C1005X7R1H104K050BB  [FP-C1005-050-0_05-IPC_C]  (value not drawn)
C29  CL05A106MP5NUNC  [FP-CL05A106MP5NUNC-MFG]  (value not drawn)
C30  C0402C103M5RACTU  [FP-C0402-BB-MFG]  (value not drawn)
C31  CL05A106MP5NUNC  [FP-CL05A106MP5NUNC-MFG]  (value not drawn)
C32  C0402C103M5RACTU  [FP-C0402-BB-MFG]  (value not drawn)
C33  CL05A106MP5NUNC  [FP-CL05A106MP5NUNC-MFG]  (value not drawn)
C34  C0402C103M5RACTU  [FP-C0402-BB-MFG]  (value not drawn)
C35  CL05A106MP5NUNC  [FP-CL05A106MP5NUNC-MFG]  (value not drawn)
C36  C0402C103M5RACTU  [FP-C0402-BB-MFG]  (value not drawn)
C40  GRM188R60J106ME47D  [FP-GRM188-0_1-e0_2_0_55-IPC_A]  (value not drawn)
C41  GRM188R60J106ME47D  [FP-GRM188-0_1-e0_2_0_55-IPC_A]  (value not drawn)
C42  C1005X7R1H104K050BB  [FP-C1005-050-0_05-IPC_C]  (value not drawn)
C43  C1005X7R1H104K050BB  [FP-C1005-050-0_05-IPC_C]  (value not drawn)
C121  GRM21BR61E226ME44L  [FP-GRM21B-0_2-e0_2_0_7-IPC_B]  (value not drawn)
C122  GRM21BR61E226ME44L  [FP-GRM21B-0_2-e0_2_0_7-IPC_B]  (value not drawn)
C123  GRM21BR61E226ME44L  [FP-GRM21B-0_2-e0_2_0_7-IPC_B]  (value not drawn)
C124  GRM21BR61E226ME44L  [FP-GRM21B-0_2-e0_2_0_7-IPC_B]  (value not drawn)
D22  ESD204DQAR  [FP-DQA0010A-MFG]
D23  ESD204DQAR  [FP-DQA0010A-MFG]
D34  ESD204DQAR  [FP-DQA0010A-MFG]
D35  ESD204DQAR  [FP-DQA0010A-MFG]
J2  FM4-NZRP-PCB-1  [FM4-NZRP-PCB-1-Footprint-1]
L2  ADL32VHC-220M  [FP-1210POC-MFG]
L3  PFL1609-561MEW  [FP-PFL1609-MFG]
L4  ADL32VHC-220M  [FP-1210POC-MFG]
L5  PFL1609-561MEW  [FP-PFL1609-MFG]
L6  ADL32VHC-220M  [FP-1210POC-MFG]
L7  PFL1609-561MEW  [FP-PFL1609-MFG]
L8  ADL32VHC-220M  [FP-1210POC-MFG]
L9  PFL1609-561MEW  [FP-PFL1609-MFG]
R5  0402 JUMPER 0 OHM  [RESC1005X40X25NL05T05]  (value not drawn)
R6  0402 JUMPER 0 OHM  [RESC1005X40X25NL05T05]  (value not drawn)
R7  0402 JUMPER 0 OHM  [RESC1005X40X25NL05T05]  (value not drawn)
R8  0402 JUMPER 0 OHM  [RESC1005X40X25NL05T05]  (value not drawn)
R9  ERJ3EKF1002V  [RESC1609X55X30LL15T15]
R10  ERJ-3EKF49R9V  [RESC1608X55X30ML15T15]
R11  ERJ-3EKF49R9V  [RESC1608X55X30ML15T15]
R12  ERJ-3EKF8062V  [RESC1608X55X30LL15T15]
R13  ERJ-3EKF8062V  [RESC1608X55X30LL15T15]
R14  0402 JUMPER 0 OHM  [RESC1005X40X25NL05T05]  (value not drawn)
R15  ERJ-3EKF2052V  [RESC1608X55X30NL15T15]
R16  ERJ-3EKF2052V  [RESC1608X55X30NL15T15]
R17  ERJ3EKF1002V  [RESC1609X55X30LL15T15]
R18  ERJ-3EKF49R9V  [RESC1608X55X30ML15T15]
R19  ERJ-3EKF49R9V  [RESC1608X55X30ML15T15]
R20  ERJ-3EKF4020V  [RESC1608X55X30LL15T15]
R21  ERJ3EKF1002V  [RESC1609X55X30LL15T15]
R24  ERJ-3EKF5101V  [FP-ERJ3EK-MFG]
R26  ERJ-3EKF5101V  [FP-ERJ3EK-MFG]
R27  ERJ-3EKF5101V  [FP-ERJ3EK-MFG]
R29  ERJ-3EKF5101V  [FP-ERJ3EK-MFG]
U1  MAX96724RGTN/V+  [QFN50P800X800X80_HS-57N]  (parts A,B of 2)
U2  LD1117S18TR  [SOT-223_M]
U3  AP7363-12E-13  [SOT-223_M]
Y1  ABM8G-25.000MHZ-18-D2Y-T  [FP-ABM8G-MFG]

### Ports
CAM_I2C_SCL (in, see MAIN_BOARD[5B], JETSON[8B]), CAM_I2C_SDA (bidir, see MAIN_BOARD[5B], JETSON[8B]), CAM_nPWDN (in, see MAIN_BOARD[5B]), CSI_CK_N (in, see MAIN_BOARD[5B]), CSI_CK_P (in, see MAIN_BOARD[5B]), CSI_D0_N (bidir, see MAIN_BOARD[5B]), CSI_D0_P (bidir, see MAIN_BOARD[5B]), CSI_D1_N (bidir, see MAIN_BOARD[5B]), CSI_D1_P (bidir, see MAIN_BOARD[5B]), CSI_D2_N (bidir, see MAIN_BOARD[5B]), CSI_D2_P (bidir, see MAIN_BOARD[5B]), CSI_D3_N (bidir, see MAIN_BOARD[5B]), CSI_D3_P (bidir, see MAIN_BOARD[5B]), PoC_PWR (in, see MAIN_BOARD[5B])

### Nets
2V_AUX: C42.2 C43.2 U2.3(VIN) U3.3(VIN)
3V3: C33.1 C34.2 R9.2 R12.2 R13.2 R17.2 R21.2 U1.24(VDDIO)
GND: C19.2 C20.2 C21.2 C22.1 C23.2 C24.1 C25.2 C26.1 C27.2 C28.1 C29.2 C30.1 C31.2 C32.1 C33.2 C34.1 C35.2 C36.1 C40.2 C41.2 C42.1 C43.1 C121.2 C122.2 C123.2 C124.2 D22.3(GND) D22.8(GND) D23.3(GND) D23.8(GND) D34.3(GND) D34.8(GND) D35.3(GND) D35.8(GND) J2.MH1 J2.MH2 J2.MH3 J2.MH4 J2.MH5 R10.1 R11.1 R15.1 R16.1 R18.1 R19.1 R20.1 U1.57(GND) U2.1(GND) U3.1(GND) Y1.2(GND) Y1.4(GND)
CAM_1V2: C25.1 C26.2 C27.1 C28.2 C35.1 C36.2 C41.1 U1.30(VTERM) U1.55(VDD) U1.56(VDD) U3.2(VOUT) U3.4(VOUT)
CAM_1V8: C29.1 C30.2 C31.1 C32.2 C40.1 U1.7(VDD18) U1.21(VDD18) U2.2(VOUT) U2.4(VOUT)
CAM_I2C_SCL: R21.1 U1.29(SCL) ; port CAM_I2C_SCL
CAM_I2C_SDA: R17.1 U1.28(SDA) ; port CAM_I2C_SDA
CK_N: C14.2 R7.2 R8.2
CK_P: C11.2 R5.2 R6.2
CKA_N: R8.1 U1.40(CKAN)
CKA_P: R6.1 U1.39(CKAP)
CKC_N: R7.1 U1.34(CKCN)
CKC_P: R5.1 U1.33(CKCP)
DA0_N: C2.2 U1.32(DA0N)
DA0_P: C1.2 U1.31(DA0P)
DA1_N: C4.2 U1.36(DA1N)
DA1_P: C3.2 U1.35(DA1P)
DA2_N: C6.2 U1.38(DA2N)
DA2_P: C5.2 U1.37(DA2P)
DA3_N: C10.2 U1.42(DA3N)
DA3_P: C9.2 U1.41(DA3P)
nPWDN: R14.2 ; port CAM_nPWDN
PoC_A: C7.2 D22.1(IO1) D22.10(NC) J2.3 L3.2  [also labelled RF_A]
PoC_B: C8.2 D22.5(IO4) D22.6(NC) D34.5(IO4) D34.6(NC) J2.4 L5.2  [also labelled RF_B]
PoC_C: C15.2 D23.1(IO1) D23.10(NC) J2.1 L7.2  [also labelled RF_C]
PoC_D: C16.2 D35.5(IO4) D35.6(NC) J2.2 L9.2  [also labelled RF_D]
PoC_PWR: C121.1 C122.1 C123.1 C124.1 L2.1 L4.1 L6.1 L8.1 R24.1 R26.1 R27.1 R29.1 ; port PoC_PWR
SIOA_N: C12.1 U1.22(SIOAN)
SIOA_P: C7.1 U1.23(SIOAP)
SIOB_N: C13.1 U1.19(SIOBN)
SIOB_P: C8.1 U1.18(SIOBP)
SIOC_N: C17.1 U1.9(SIOCN)
SIOC_P: C15.1 U1.10(SIOCP)
SIOD_N: C18.1 U1.6(SIODN)
SIOD_P: C16.1 U1.5(SIODP)
X25_N: C20.1 U1.16(X2) Y1.3
X25_P: C19.1 U1.15(X1/OSC) Y1.1
XRES: R20.2 U1.17(XRES)
NetC1_1: C1.1 ; port CSI_D0_P
NetC2_1: C2.1 ; port CSI_D0_N
NetC3_1: C3.1 ; port CSI_D1_P
NetC4_1: C4.1 ; port CSI_D1_N
NetC5_1: C5.1 ; port CSI_D2_P
NetC6_1: C6.1 ; port CSI_D2_N
NetC9_1: C9.1 ; port CSI_D3_P
NetC10_1: C10.1 ; port CSI_D3_N
NetC11_1: C11.1 ; port CSI_CK_P
NetC12_2: C12.2 R10.2
NetC13_2: C13.2 R11.2
NetC14_1: C14.1 ; port CSI_CK_N
NetC17_2: C17.2 R18.2
NetC18_2: C18.2 R19.2
NetC21_1: C21.1 C22.2 U1.8(CAP_VDD)
NetC23_1: C23.1 C24.2 U1.20(CAP_VDD)
NetL2_2: L2.2 L3.1 R24.2
NetL4_2: L4.2 L5.1 R26.2
NetL6_2: L6.2 L7.1 R27.2
NetL8_2: L8.2 L9.1 R29.2
NetR9_1: R9.1 R14.1 U1.11(PWDNB)
NetR12_1: R12.1 R15.2 U1.25(CFG1/MFP6)
NetR13_1: R13.1 R16.2 U1.4(CFG0)

Not connected (* = marked no-connect by the designer): D22 2(IO2) 4(IO3) 7(NC) 9(NC); D23 2(IO2) 4(IO3) 5(IO4) 6(NC) 7(NC) 9(NC); D34 1(IO1) 2(IO2) 4(IO3) 7(NC) 9(NC) 10(NC); D35 1(IO1) 2(IO2) 4(IO3) 7(NC) 9(NC) 10(NC); U1 1(MFP0)* 2(MFP1)* 3(MFP2)* 12(MFP3)* 13(MFP4)* 14(MFP5)* 26(SDA1/MFP7)* 27(SCL1/MFP8)* 43(NC)* 44(NC)* 45(NC)* 46(NC)* 47(NC)* 48(NC)* 49(NC)* 50(NC)* 51(NC)* 52(NC)* 53(NC)* 54(NC)*

### Layout directives
differential pair; differential pair class 100DIFF: CK_N, CK_P, CKA_N, CKA_P, CKC_N, CKC_P, DA0_N, DA0_P, DA1_N, DA1_P, DA2_N, DA2_P, DA3_N, DA3_P, NetC1_1, NetC2_1, NetC3_1, NetC4_1, NetC5_1, NetC6_1, NetC9_1, NetC10_1, NetC11_1, NetC14_1, SIOA_N, SIOA_P, SIOB_N, SIOB_P, SIOC_N, SIOC_P, SIOD_N, SIOD_P
net class 50SINGLE: CK_N, CK_P, CKA_N, CKA_P, CKC_N, CKC_P, DA0_N, DA0_P, DA1_N, DA1_P, DA2_N, DA2_P, DA3_N, DA3_P, PoC_A, PoC_B, PoC_D, RF_A, RF_B, RF_C, RF_D, SIOA_N, SIOA_P, SIOB_N, SIOB_P, SIOC_N, SIOC_P, SIOD_N, SIOD_P
differential pair: X25_N, X25_P

### Notes on the sheet
- CSI + I2C + PoC IN
- GMSL Aggregator
- COAX Inputs
- (near R5) CLK MUX TO MAKE SURE CLK CAN BE WIRED
- (near R5) CSI WIRING AS PER PAGE 23 OF MAX96724 DS
- COAX is ok as 50ohm single ended but remove ground plane from under the pads of passives connected to the GMSL trace
- Line fault?
- prob no since poc>>
- I2C ADDR 0x5C
- (near R13) REMOVE PULLUP FOR 0x4E
- PLACE ALL PASSIVES AS CLOSE AS POSSIBLE TO MAX96724
- (near R15) GMSL2 3GB/s mode
- (near R15) COAX +
- Table 7 and 8 of DS for CFG configs
- 3V3 OR 1V8 I/O???
- MAX96724 has internal pull up but I added more
- MAX96724 PIN CONFIGS
- XRES --> 402 1% TO GND
  X1/X2 --> 30PF CAP --> 2*(CL-CSTRAY)
  SDA/SCL --> OK, EXTRA PULLUPS ADDED BUT INTERNAL ONES EXIST
  SDA1/SCL1 --> COULD CONVERT TO HSYNC/VSYNC FOR STATUS LEDS
  CFG1 --> GMSL2 3GB/s OVER COAX (TABLE 8 OF DS)
  CFG0 --> I2C ADDR (TABLE 7 OF DS)
  COMPONENT SUGGESTIONS IN TABLE 3 OF DS
  - DECOUPLING CAPS OK
- FAKRA + ESD PROT
- Cable assembly --> 095-820-157-006
  Connector --> FM4-NZRP-PCB-1
- (near U1) Alas we require 1V2, 1V8, and 3V3 for these fuckers. Probably do buck for 3V3 and LDO for 1V2 and 1V8 but ask smarter humans first
- Maybe LDO for 3V3 would be worthwhile
- BUCK + 1V2 & 1V8 LDOs
- PoC Supply
- Maybe add switch + ldo if core current is high - it's 600mA on the 1V2 rail alone so yes
- Table 5 of gmsl2 hardware design guide from analog
- POWER OVER COAX DIRECTLY FROM BATT SHOULD BE FINE PROVIDED THERE'S ENOUGH FILTERING - CASS
- Using C-2L-500 Coilcraft (#3) circuit but replaced  1210POC-223
- UNLABELLED RESISTORS ARE 0402 JUMPERS
- SERBAN THINKS THIS IS OK, MAY FIND MISTAKES WHILE ROUTING THOUGH
- (in symbol CMP-015-00011-2, part A) 1 of 2
- (in symbol CMP-015-00011-2, part B) 2 of 2

### Library data of the parts
C1-C18 C22 C24 C26 C28 C42 C43 = CMP-2000-05393-2: Multilayer Ceramic Capacitors 100nF ±10% 50V X7R SMD 0402; Voltage: 50V; Dielectric Material: Ceramic; Min Operating Temperature: -55°C; Depth: 0.5mm; Radiation Hardening: No; RoHS Compliant: Yes; Voltage Rating (DC): 50V; Lead Free: Lead Free; Resistor Type: Ceramic; Height: 0.5mm; Dielectric: X7R; Thickness: 0.022inch; Case/Package: 0402; Case Code (Metric): 1005; Termination: SMD/SMT; Capacitance: 100nF; Packaging: Tape and Reel; Max Operating Temperature: 125°C; Mount: Surface Mount; Package Quantity: 1; Width: 0.02inch; Weight: 2.3E-05oz; Voltage Rating: 50V; Tolerance: 10%; Construction: Flat; Case Code (Imperial): 0402; Length: 1mm; REACH SVHC: No SVHC; Series: C
C19 C20 = CMP-1035-00914-3: CAP CER 30PF 50V 5% NP0 0603; Manufacturer: KEMET; Automotive Grade: Grade 1; Temperature Coefficient: 30ppm/°C; Material: Ceramic; Temperature Characteristic: C0G; Tolerance: 0.05; Manufacturer Part Number: C0603C300J5GACTU; ComponentLink2URL: https://api.kemet.com/component-edge/download/datasheet/C0603C100J5GACAUTO.pdf; Automotive: Yes; Device Class L2: Capacitors; Device Class L1: Passive Components; Device Class L3: Ceramic Capacitors; RoHS: TRUE; Octopart: https://octopart.com/c0603c300j5gactu-kemet-199455; Lead Free: Yes; Value: 30 pF; Temperature Range High: +125°C; Category: Cap; Temperature: -55°C to +125°C; Package: C0603C-CF; Capacitance: 30 pF; Digikey Description: CAP CER 30PF 50V 5% NP0 0603; Height: 0.87mm; ComponentLink2Description: Datasheet; Temperature Range Low: -55°C; Mouser Description: Multilayer Ceramic Capacitors MLCC - SMD/SMT 50volts 30pF C0G 5%; Voltage Rating: 50 V
C21 C23 C25 C27 C29 C31 C33 C35 = CMP-13271-000002-1: CAP CER 10UF 10V X5R 0402; Manufacturer: Samsung; Temperature Coefficient: 15%; Tolerance: 20%; Material: Ceramic; Octopart: https://octopart.com/cl05a106mp5nunc-samsung-22457395; Voltage Rating: 10V; RoHS: TRUE; Value: 10uF; Height: 0.7mm; Digikey Description: CAP CER 10UF 10V X5R 0402; Automotive: No; Package: CL05A106MP5NUNC; Device Class L1: Passive Components; Capacitance: 10uF; Temperature Range High: +85°C; ComponentLink2Description: Datasheet; Device Class L2: Capacitors; Temperature Characteristic: X5R; Manufacturer Part Number: CL05A106MP5NUNC; Temperature: -55°C to +85°C; ComponentLink2URL: http://www.samsungsem.com/kr/support/product-search/mlcc/__icsFiles/afieldfile/2019/05/10/19-CL05A106MP5NUNC.pdf; Device Class L3: Ceramic Capacitors; Category: Cap; Temperature Range Low: -55°C; Ipc Land Pattern Name: CAPC10050X50; Lead Free: Yes
C30 C32 C34 C36 = CMP-1034-01887-3: CAP CER 10000PF 50V 20% X7R 0402; Manufacturer: Kemet; Value: 10,000 pF; Tolerance: 0.2; Temperature Coefficient: 15%; Material: Ceramic; Temperature Range Low: -55°C; Digikey Description: CAP CER 10000PF 50V 20% X7R 0402; Temperature Characteristic: X7R; Device Class L2: Capacitors; RoHS: TRUE; Temperature Range High: +125°C; Mouser Description: Cap Ceramic 0.01uF 50V X7R 20% SMD 1.0 x 0.5 mm 125 C Paper T/R; Package: C0402-BB; ComponentLink2URL: https://content.kemet.com/datasheets/KEM_C1002_X7R_SMD.pdf; Device Class L1: Passive Components; ComponentLink2Description: Datasheet; Height: 0.55mm; Automotive: No; Temperature: -55°C to +125°C; Capacitance: 10,000 pF; Manufacturer Part Number: C0402C103M5RACTU; Device Class L3: Ceramic Capacitors; Voltage Rating: 50 V; Ipc Land Pattern Name: CAPC10050X50; Category: Cap; Octopart: https://octopart.com/c0402c103m5ractu-kemet-17125571; Lead Free: Yes
C40 C41 = CMP-2006-02792-2: Chip Multilayer Ceramic Capacitors for General Purpose, 0603, 10uF, X5R, 15%, 20%, 6.3V; Packaging: Tape and Reel; Voltage Rating (DC): 6.3V; Width: 0.031inch; Termination: SMD/SMT; Dielectric: X5R; Package Quantity: 4000; Voltage Rating: 6.3V; Capacitance: 10uF; Case/Package: 0603; Min Operating Temperature: -55°C; Voltage: 6.3V; Length: 1.6mm; Thickness: 0.035inch; Lead Free: Lead Free; Depth: 0.8mm; Case Code (Imperial): 0603; Max Operating Temperature: 85°C; Material: Ceramic; Height: 0.8mm; Tolerance: 20%; Mount: Surface Mount; REACH SVHC: No SVHC; Radiation Hardening: No; Case Code (Metric): 1608
C121-C124 = CMP-2007-03222-3: Chip Multilayer Ceramic Capacitors for General Purpose, 0805, 22uF, X5R, 15%, 20%, 25V; Case/Package: 0805; Depth: 1.25mm; Resistor Type: Ceramic; Voltage Rating: 25V; Lead Free: Lead Free; Voltage Rating (DC): 25V; Case Code (Metric): 2012; Thickness: 0.057inch; REACH SVHC: No SVHC; Material: Ceramic; Tolerance: 20%; Length: 2mm; Capacitance: 22uF; Case Code (Imperial): 0805; Max Operating Temperature: 85°C; Termination: SMD/SMT; Weight: 0.000335oz; Dielectric: X5R; Packaging: Tape and Reel; Voltage: 25V; Package Quantity: 3000; Height: 1.25mm; Mount: Surface Mount; Width: 1.25mm; Min Operating Temperature: -55°C
D22 D23 D34 D35 = CMP-04989-000002-1: as D1 on sheet JETSON; Ambient Temperature Range High: +125°C; ComponentLink2Description: Datasheet; Height: 0.55mm; Lead Free: Yes; Device Class L3: unset; Temperature Range High: +125°C; Temperature Range Low: -40°C; Package: DQA0010A; Temperature: -40°C to +125°C; Capacitance: 0.55pF; RoHS: TRUE; Mouser Description: 4-Channel Low-Capacitance Surge and ESD Protection Diode 10-USON -40 to 125; Category: Diode; Device Class L1: Circuit Protection; Octopart: https://octopart.com/esd204dqar-texas+instruments-89917476; Device Class L2: TVS Diodes; Ambient Temperature Range Low: -40°C; Manufacturer Part Number: ESD204DQAR; ComponentLink2URL: http://www.ti.com/lit/ds/symlink/esd204.pdf; Automotive: No; Digikey Description: 4-CHANNEL LOW-CAPACITANCE SURGE
J2 = CMP-002-00085-1: Connector RF Mini-FAKRA Plug 9GHz 50Ohm Solder Right Angle Through Hole
L2 L4 L6 L8 = CMP-11268-000041-1: NOT COILCRAFT - ACTUAL P# --> ADL32VHC-220M / - Power Injection Chokes for PoC; Manufacturer Part Number: 1210POC-223MRC; Value: 22uH; Core Material: Ferrite; Saturation Current: 720mA; Series Resistance: 0.88Ω; Rms Current: 700mA; Automotive Grade: Grade 1; Self Resonant Frequency: 70MHz; Test Frequency: 100kHz; Tolerance: 20%; Ambient Temperature Range High: +125°C; Manufacturer: coilcraft; Octopart: https://octopart.com/1210poc-223mrc-coilcraft-103207315; Category: Ind; Device Class L2: Inductors; RoHS: TRUE; Device Class L3: Fixed Inductors; Package: 1210POC; Ambient Temperature Range Low: -40°C; ComponentLink2URL: https://drive.google.com/open?id=15FlOq8Y4YbRFohfA_cJ40jgnqs8va2Mh; Lead Free: Yes; Inductance: 22uH; Device Class L1: Passive Components; ComponentLink2Description: Datasheet; Automotive: Yes; Height: 3mm
L3 L5 L7 L9 = CMP-11268-000007-1: Fixed Inductors PFL1609 Low Profile 0.56 uH 20 % 1.4 A; Manufacturer: coilcraft; Rms Current: 1100mA; Self Resonant Frequency: 600MHz; Core Material: Composite; Tolerance: 20%; Value: 0.56uH; Automotive Grade: Grade 1; Saturation Current: 710mA; Test Frequency: 7.9MHz; Shielding: true; Series Resistance: 130mΩ; Lead Free: Yes; Device Class L1: Passive Components; Package: PFL1609; Octopart: https://octopart.com/pfl1609-561mew-coilcraft-20329171; ComponentLink2URL: https://www.coilcraft.com/pdfs/pfl1609.pdf; Manufacturer Part Number: PFL1609-561MEW; Ambient Temperature Range Low: -40°C; Composition: Wirewound; Inductance: 0.56uH; Device Class L2: Inductors; Category: Ind; Device Class L3: Fixed Inductors; Mouser Description: Fixed Inductors PFL1609 Low Profile 0.56 uH 20 % 1.4 A; Automotive: Yes; ComponentLink2Description: Datasheet; Ambient Temperature Range High: +105°C; Height: 0.95mm; RoHS: TRUE
R5-R8 R14 = CMP-009-00206-2: READ THE NAME
R9 R17 R21 = CMP-1012-00623-3: as R22 on sheet JETSON; Number of Pins: 2; Package Reference: 603; Depth: 0.8mm; Mount: SurfaceMount; Package Description: 2-Pin Surface Mount Device, Body 1.6 x 0.85 mm; Datasheet Version: 02/2017; Length: 1.6mm; Lead Free: LeadFree; Height: 0.45mm; Number of Terminations: 2; Max Power Dissipation: 100mW; Min Operating Temperature: -55degC; Datasheet URL: https://industrial.panasonic.com/cdbs/www-data/pdf/RDA0000/AOA0000C304.pdf; Termination: SMD/SMT; Case Code (Metric): 1608; Case Code (Imperial): 0603; Tolerance: 1%; Max Operating Temperature: 155degC; RoHSCompliant: true; Voltage Rating (DC): 75V; Radiation Hardening: No; Packaging: TapeandReel; Composition: ThickFilm; Mounting Technology: SurfaceMount; Manufacturer URL: http://www.panasonic.com/; Width: 0.031inch; REACH SVHC: NoSVHC; Contact Plating: Tin; Military Standard: Not; Package Quantity: 1
R10 R11 R18 R19 = CMP-2000-00538-1: Manufacturer: Panasonic; Part Number: ERJ-3EKF49R9V
R12 R13 = CMP-2000-00651-1: Manufacturer: Panasonic; Part Number: ERJ-3EKF8062V
R15 R16 = CMP-2000-00323-1: Manufacturer: Panasonic; Part Number: ERJ-3EKF2052V
R20 = CMP-2000-00484-1: Manufacturer: Panasonic; Part Number: ERJ-3EKF4020V
R24 R26 R27 R29 = CMP-2000-00540-8: RES SMD 5.1K OHM 1% 1/10W 0603; Power Rating: 100mW; Temperature Coefficient: 100ppm/°C; Voltage Rating: 75V; Resistance: 5.1kR; Military Standard: Not; Case/Package: 0603; Packaging: Tape and Reel; Package Quantity: 1; Reach SVHC Compliant: Yes; Lead Free: Lead Free; Mount: Surface Mount; Size Code: 0603; Depth: 0.8mm; Resistance Tolerance: 1%; Number of Terminations: 2; Resistor Type: Thick Film; Width: 0.8mm; Construction: Rectangular; Series: ERJ; Radiation Hardening: No; Max Operating Temperature: 155°C; Features: Automotive AEC-Q200; Tolerance: 1%; Voltage Rating (DC): 75V; Length: 1.6mm; RoHS Compliant: Yes; Min Operating Temperature: -55°C; Case Code (Metric): 1608; Termination: SMD/SMT; Weight: 7.1E-05oz; Max Power Dissipation: 100mW; Contact Plating: Tin; Height: 0.022inch; Case Code (Imperial): 0603
U1 = CMP-015-00011-2: Quad Tunneling GMSL2/1 to CSI-2 Deserializer
U2 = CMP-0244-00308-1: Fixed Low Drop Positive Voltage Regulator, 1.8V, 4-Pin SOT-223, Tape and Reel; ComponentLink1URL: http://www.st.com; PackageReference: SOT-223; PackageDescription: 4-Pin SOT-223 Package, 6.5 x 3.5 mm Body, 2.3 mm Pitch, 7 mm Lead Span; ComponentLink2URL: http://www.st.com/internet/com/TECHNICAL_RESOURCES/TECHNICAL_LITERATURE/DATASHEET/CD00000544.pdf; ComponentLink2Description: Datasheet; ComponentLink1Description: Manufacturer URL; DatasheetVersion: 1/11/2011; PackageVersion: 2010
U3 = CMP-0244-00318-1: Fixed Low Drop Positive Voltage Regulator, 1.2V (pn is for 1.5A LDO), 4-Pin SOT-223, Tape and Reel; PackageDescription: 4-Pin SOT-223 Package, 6.5 x 3.5 mm Body, 2.3 mm Pitch, 7 mm Lead Span; PackageVersion: 2010; ComponentLink2Description: Datasheet; PackageReference: SOT-223; ComponentLink2URL: http://www.st.com/internet/com/TECHNICAL_RESOURCES/TECHNICAL_LITERATURE/DATASHEET/CD00000544.pdf; ComponentLink1Description: Manufacturer URL; DatasheetVersion: 1/11/2011; ComponentLink1URL: http://www.st.com
Y1 = CMP-2000-05733-3: Crystal 25MHz ±20ppm (Tol) ±30ppm (Stability) 18pF FUND 60Ω 4-Pin SMD T/R; Series Resistance: 60R; Length: 3.2mm; Depth: 2.5mm; Packaging: Tape and Reel; Min Operating Temperature: -40°C; Operating Frequency: 25 MHz; Lead Free: Lead Free; Number of Pins: 4; Frequency Tolerance: 20ppm; Radiation Hardening: No; Max Operating Temperature: 85°C; Termination: SMD/SMT; Frequency Stability: 30ppm; Frequency: 25MHz; Series: ABM8G; Mount: Surface Mount; Package Quantity: 1000; Height: 0.039inch; Width: 0.098inch; Case/Package: CSMD; ESR (Equivalent Series Resistance): 60R; Load Capacitance: 18pF; Tolerance: 20ppm

## Sheet FAN_IF.SchDoc
size A4; SheetNumber: 9; SheetTotal: 9

## Nets that join several sheets
GND: JETSON (114 pins), CAMERA_INTERFACE (51 pins)
CAM_I2C_SCL: JETSON (D18.4 D18.7 J1.213), CAMERA_INTERFACE (R21.1 U1.29)
CAM_I2C_SDA: JETSON (D18.5 D18.6 J1.215), CAMERA_INTERFACE (R17.1 U1.28)